# Altium project RD044-NETLIST2-CR5-01.PrjPcb
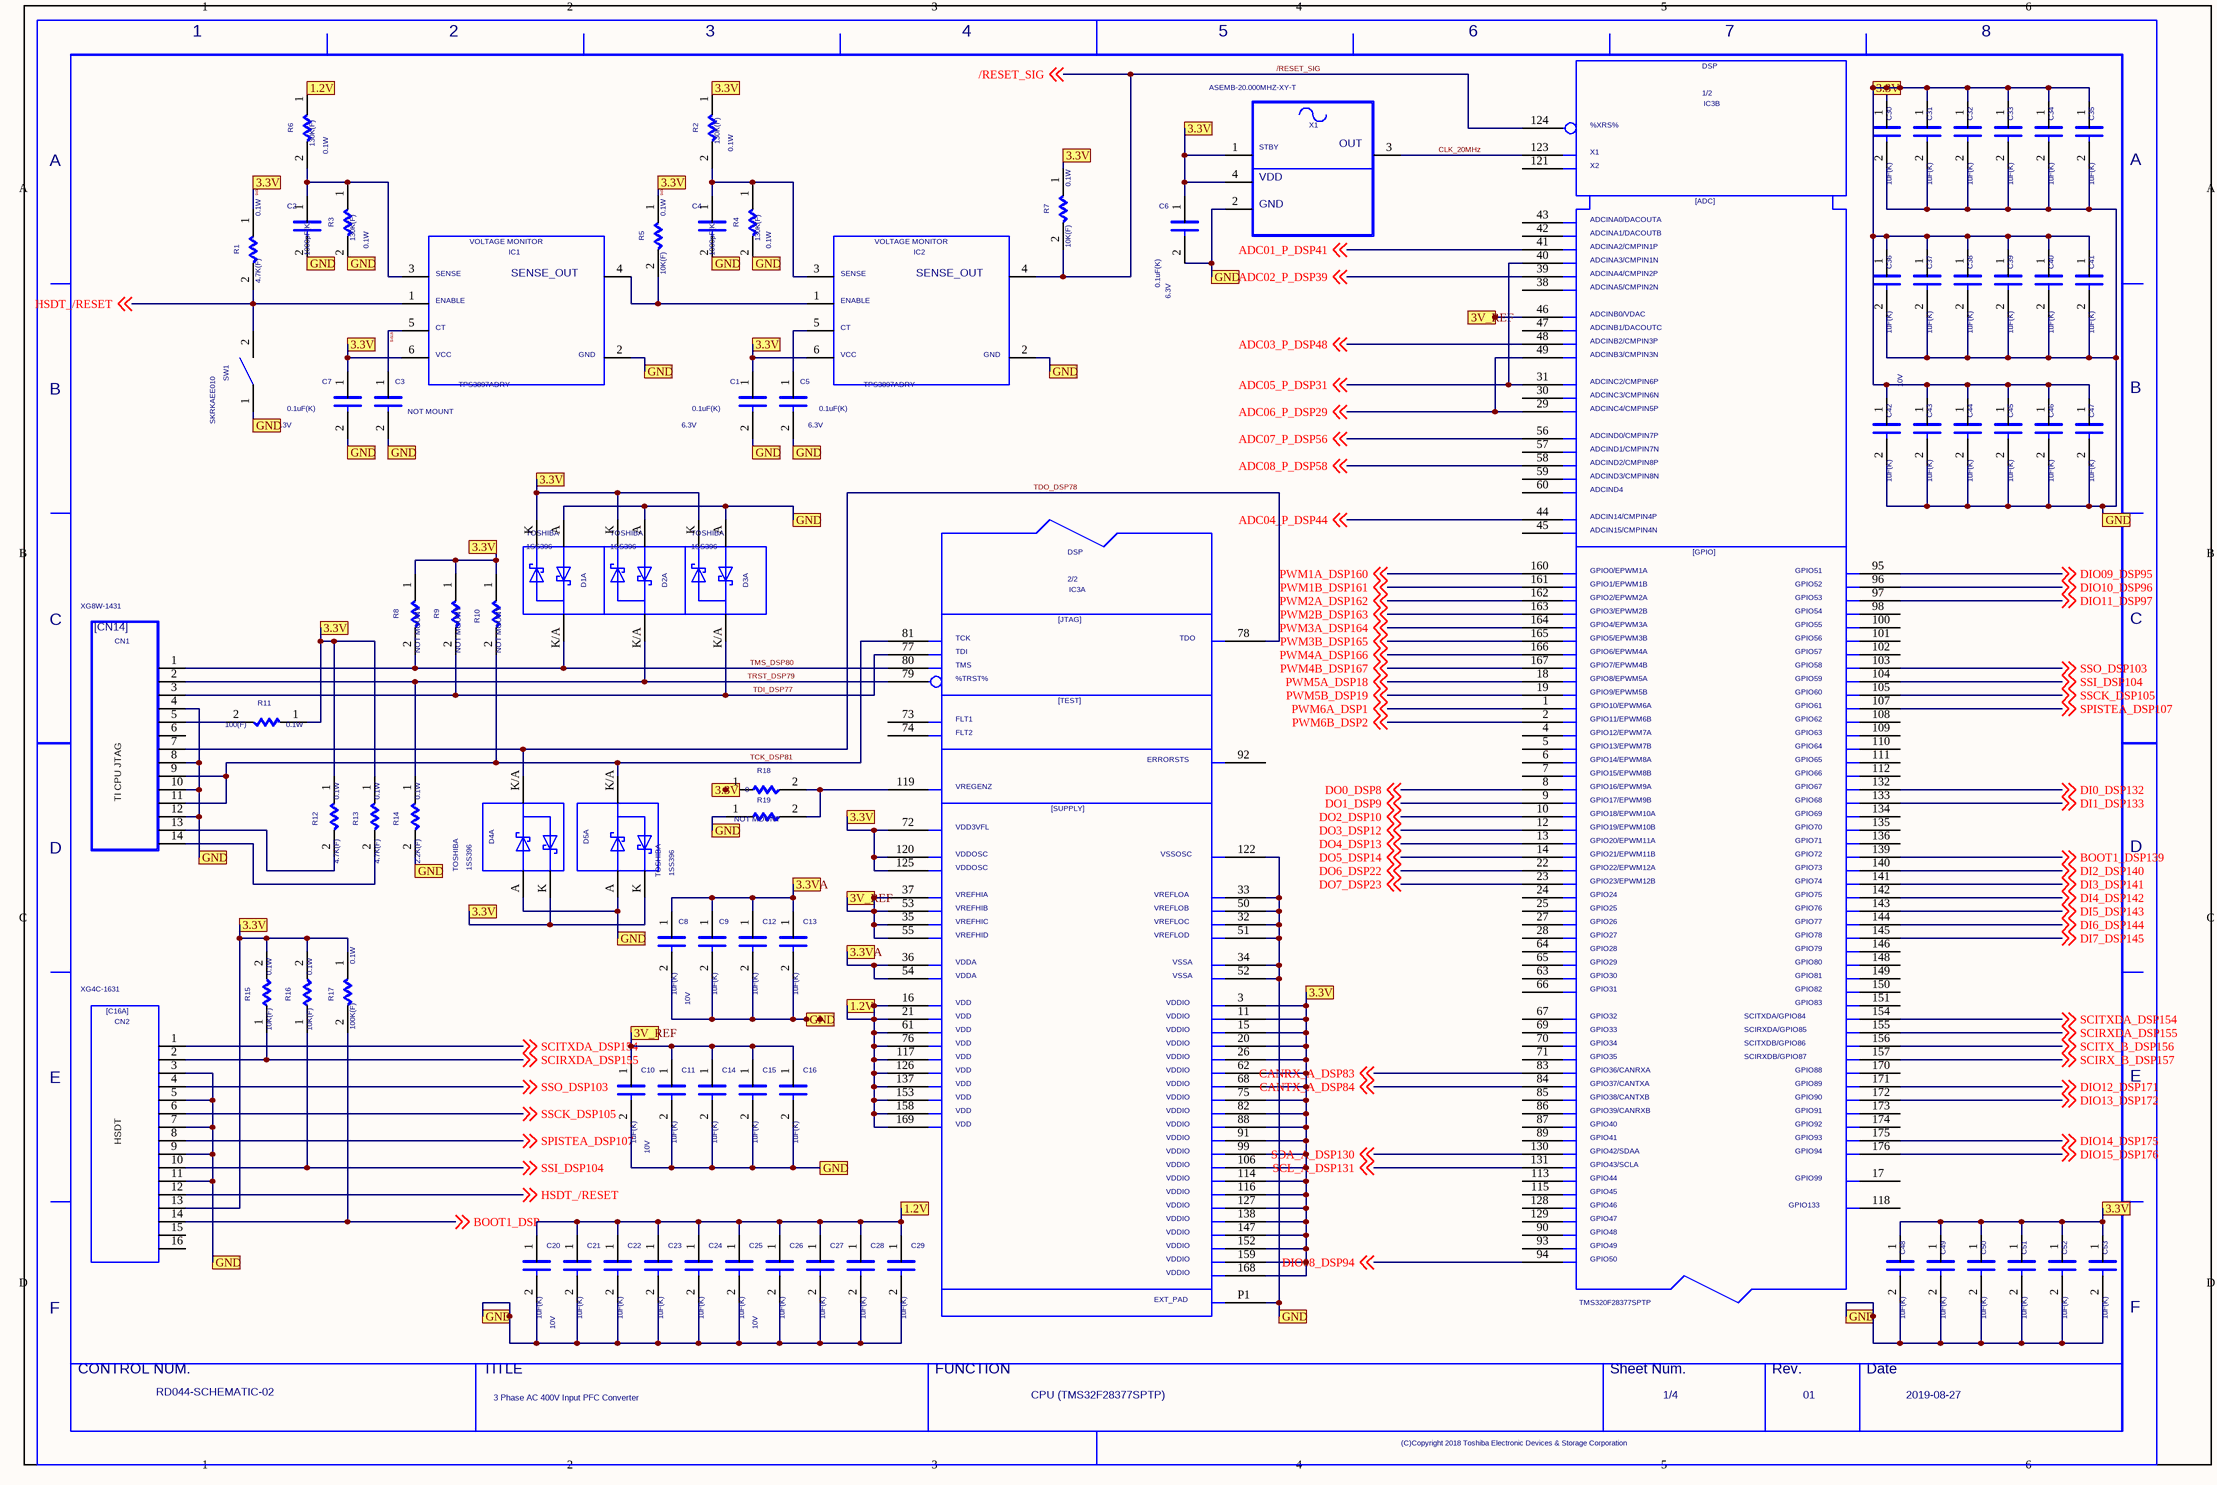
[diagram p0: 1.SchDoc]
4 sheets, 296 parts. Net scope: flat (ports and power ports of the same name join across sheets).
Sheets:
  1.SchDoc
  2.SchDoc
  3.SchDoc
  4.SchDoc

## Sheet 1.SchDoc
size 411 x 274 mm

### Parts
(Parts that share a designator on the sheet are numbered #1, #2 ... from top to bottom, then left to right.)
C1  VAL2: 6.3V  VAL1: 0.1uF(K)  (hidden comment: C)
C2  VAL2: 16V  VAL1: 1000pF(K)  (hidden comment: C)
C3  NOTMOUNT: NOT MOUNT  (hidden comment: C)
C4  VAL2: 16V  VAL1: 1000pF(K)  (hidden comment: C)
C5  VAL2: 6.3V  VAL1: 0.1uF(K)  (hidden comment: C)
C6  VAL2: 6.3V  VAL1: 0.1uF(K)  (hidden comment: C)
C7  VAL2: 6.3V  VAL1: 0.1uF(K)  (hidden comment: C)
C8  VAL2: 10V  VAL1: 1uF(K)  (hidden comment: C)
C9  VAL1: 1uF(K)  (hidden comment: C)
C10  VAL2: 10V  VAL1: 1uF(K)  (hidden comment: C)
C11  VAL1: 1uF(K)  (hidden comment: C)
C12  VAL1: 1uF(K)  (hidden comment: C)
C13  VAL1: 1uF(K)  (hidden comment: C)
C14  VAL1: 1uF(K)  (hidden comment: C)
C15  VAL1: 1uF(K)  (hidden comment: C)
C16  VAL1: 1uF(K)  (hidden comment: C)
C20  VAL2: 10V  VAL1: 1uF(K)  (hidden comment: C)
C21  VAL1: 1uF(K)  (hidden comment: C)
C22  VAL1: 1uF(K)  (hidden comment: C)
C23  VAL1: 1uF(K)  (hidden comment: C)
C24  VAL1: 1uF(K)  (hidden comment: C)
C25  VAL2: 10V  VAL1: 1uF(K)  (hidden comment: C)
C26  VAL1: 1uF(K)  (hidden comment: C)
C27  VAL1: 1uF(K)  (hidden comment: C)
C28  VAL1: 1uF(K)  (hidden comment: C)
C29  VAL1: 1uF(K)  (hidden comment: C)
C30  VAL1: 1uF(K)  (hidden comment: C)
C31  VAL1: 1uF(K)  (hidden comment: C)
C32  VAL1: 1uF(K)  (hidden comment: C)
C33  VAL1: 1uF(K)  (hidden comment: C)
C34  VAL1: 1uF(K)  (hidden comment: C)
C35  VAL1: 1uF(K)  (hidden comment: C)
C36  VAL1: 1uF(K)  (hidden comment: C)
C37  VAL1: 1uF(K)  (hidden comment: C)
C38  VAL1: 1uF(K)  (hidden comment: C)
C39  VAL1: 1uF(K)  (hidden comment: C)
C40  VAL1: 1uF(K)  (hidden comment: C)
C41  VAL1: 1uF(K)  (hidden comment: C)
C42  VAL2: 10V  VAL1: 1uF(K)  (hidden comment: C)
C43  VAL1: 1uF(K)  (hidden comment: C)
C44  VAL1: 1uF(K)  (hidden comment: C)
C45  VAL1: 1uF(K)  (hidden comment: C)
C46  VAL1: 1uF(K)  (hidden comment: C)
C47  VAL1: 1uF(K)  (hidden comment: C)
C48  VAL1: 1uF(K)  (hidden comment: C)
C49  VAL1: 1uF(K)  (hidden comment: C)
C50  VAL1: 1uF(K)  (hidden comment: C)
C51  VAL1: 1uF(K)  (hidden comment: C)
C52  VAL1: 1uF(K)  (hidden comment: C)
C53  VAL1: 1uF(K)  (hidden comment: C)
CN1  VAL3: XG8W-1431  (hidden comment: CN14)
CN2  VAL3: XG4C-1631  (hidden comment: C16A)
D1  USERCOMPTEXT3: TOSHIBA  (hidden comment: 1SS396)  (part A of 3)
D2  USERCOMPTEXT3: TOSHIBA  (hidden comment: 1SS396)  (part A of 3)
D3  USERCOMPTEXT3: TOSHIBA  (hidden comment: 1SS396)  (part A of 3)
D4  USERCOMPTEXT3: TOSHIBA  (hidden comment: 1SS396)  (part A of 3)
D5  USERCOMPTEXT3: TOSHIBA  (hidden comment: 1SS396)  (part A of 3)
IC1  VAL3: TPS3897ADRY  (hidden comment: TPS3897)
IC2  VAL3: TPS3897ADRY  (hidden comment: TPS3897)
IC3  U320F28377_1  (value not drawn)  (parts A,B of 2)
R1  VAL2: 0.1W  VAL1: 4.7K(F)  (hidden comment: R)
R2  VAL2: 0.1W  VAL1: 130K(F)  (hidden comment: R)
R3  VAL2: 0.1W  VAL1: 130K(F)  (hidden comment: R)
R4  VAL2: 0.1W  VAL1: 130K(F)  (hidden comment: R)
R5  VAL2: 0.1W  VAL1: 10K(F)  (hidden comment: R)
R6  VAL2: 0.1W  VAL1: 130K(F)  (hidden comment: R)
R7  VAL2: 0.1W  VAL1: 10K(F)  (hidden comment: R)
R8  NOTMOUNT: NOT MOUNT  (hidden comment: R)
R9  NOTMOUNT: NOT MOUNT  (hidden comment: R)
R10  NOTMOUNT: NOT MOUNT  (hidden comment: R)
R11  VAL2: 0.1W  VAL1: 100(F)  (hidden comment: R)
R12  VAL2: 0.1W  VAL1: 4.7K(F)  (hidden comment: R)
R13  VAL2: 0.1W  VAL1: 4.7K(F)  (hidden comment: R)
R14  VAL2: 0.1W  VAL1: 2.2K(F)  (hidden comment: R)
R15  VAL2: 0.1W  VAL1: 10K(F)  (hidden comment: R)
R16  VAL2: 0.1W  VAL1: 10K(F)  (hidden comment: R)
R17  VAL2: 0.1W  VAL1: 100K(F)  (hidden comment: R)
R18  VAL1: 0  (hidden comment: R)
R19  NOTMOUNT: NOT MOUNT  (hidden comment: R)
SW1  VAL3: SKRKAEE010  (hidden comment: SW)
U?#1  DATE: 2019-08-27  REVISION: 01  SHEETNUMBER: 1/4  FUNCTION: CPU (TMS32F28377SPTP)  TITLE: 3 Phase AC 400V Input PFC Converter  DRAWINGNUMBER: RD044-SCHEMATIC-02  (hidden comment: WAKU_DEF100_2018)
X1  VAL3: ASEMB-20.000MHZ-XY-T  (hidden comment: ASEMB)

### Ports
1.2V, 3.3V, 3.3VA, 3V_REF, GND

### Nets
/RESET_SIG: IC2.4 IC3.124 R7.2 ; off-sheet /RESET_SIG
ADC01_P_DSP41: IC3.41 ; off-sheet ADC01_P_DSP41
ADC02_P_DSP39: IC3.39 ; off-sheet ADC02_P_DSP39
ADC03_P_DSP48: IC3.48 ; off-sheet ADC03_P_DSP48
ADC04_P_DSP44: IC3.44 ; off-sheet ADC04_P_DSP44
ADC05_P_DSP31: IC3.31 IC3.40 ; off-sheet ADC05_P_DSP31
ADC06_P_DSP29: IC3.29 IC3.49 ; off-sheet ADC06_P_DSP29
ADC07_P_DSP56: IC3.56 ; off-sheet ADC07_P_DSP56
ADC08_P_DSP58: IC3.58 ; off-sheet ADC08_P_DSP58
BOOT1_DSP: CN2.14 R17.2 ; off-sheet BOOT1_DSP
BOOT1_DSP139: IC3.139 ; off-sheet BOOT1_DSP139
CANRX_A_DSP83: IC3.83 ; off-sheet CANRX_A_DSP83
CANTX_A_DSP84: IC3.84 ; off-sheet CANTX_A_DSP84
CLK_20MHz: IC3.123 X1.3
DI0_DSP132: IC3.132 ; off-sheet DI0_DSP132
DI1_DSP133: IC3.133 ; off-sheet DI1_DSP133
DI2_DSP140: IC3.140 ; off-sheet DI2_DSP140
DI3_DSP141: IC3.141 ; off-sheet DI3_DSP141
DI4_DSP142: IC3.142 ; off-sheet DI4_DSP142
DI5_DSP143: IC3.143 ; off-sheet DI5_DSP143
DI6_DSP144: IC3.144 ; off-sheet DI6_DSP144
DI7_DSP145: IC3.145 ; off-sheet DI7_DSP145
DIO08_DSP94: IC3.94 ; off-sheet DIO08_DSP94
DIO09_DSP95: IC3.95 ; off-sheet DIO09_DSP95
DIO10_DSP96: IC3.96 ; off-sheet DIO10_DSP96
DIO11_DSP97: IC3.97 ; off-sheet DIO11_DSP97
DIO12_DSP171: IC3.171 ; off-sheet DIO12_DSP171
DIO13_DSP172: IC3.172 ; off-sheet DIO13_DSP172
DIO14_DSP175: IC3.175 ; off-sheet DIO14_DSP175
DIO15_DSP176: IC3.176 ; off-sheet DIO15_DSP176
DO0_DSP8: IC3.8 ; off-sheet DO0_DSP8
DO1_DSP9: IC3.9 ; off-sheet DO1_DSP9
DO2_DSP10: IC3.10 ; off-sheet DO2_DSP10
DO3_DSP12: IC3.12 ; off-sheet DO3_DSP12
DO4_DSP13: IC3.13 ; off-sheet DO4_DSP13
DO5_DSP14: IC3.14 ; off-sheet DO5_DSP14
DO6_DSP22: IC3.22 ; off-sheet DO6_DSP22
DO7_DSP23: IC3.23 ; off-sheet DO7_DSP23
HSDT_/RESET: CN2.12 IC1.1 R1.2 SW1.2 ; off-sheet HSDT_/RESET
N16607086: IC1.4 IC2.1 R5.2
N16607090: C4.1 IC2.3 R2.2 R4.1
N16607182: C2.1 IC1.3 R3.1 R6.2
N16607210: C5.1 IC2.5
N16608626: CN1.5 R11.2
N16609034: CN1.13 R12.2
N16609038: CN1.14 R13.2
N16609736: IC3.119 R18.2 R19.2
PWM1A_DSP160: IC3.160 ; off-sheet PWM1A_DSP160
PWM1B_DSP161: IC3.161 ; off-sheet PWM1B_DSP161
PWM2A_DSP162: IC3.162 ; off-sheet PWM2A_DSP162
PWM2B_DSP163: IC3.163 ; off-sheet PWM2B_DSP163
PWM3A_DSP164: IC3.164 ; off-sheet PWM3A_DSP164
PWM3B_DSP165: IC3.165 ; off-sheet PWM3B_DSP165
PWM4A_DSP166: IC3.166 ; off-sheet PWM4A_DSP166
PWM4B_DSP167: IC3.167 ; off-sheet PWM4B_DSP167
PWM5A_DSP18: IC3.18 ; off-sheet PWM5A_DSP18
PWM5B_DSP19: IC3.19 ; off-sheet PWM5B_DSP19
PWM6A_DSP1: IC3.1 ; off-sheet PWM6A_DSP1
PWM6B_DSP2: IC3.2 ; off-sheet PWM6B_DSP2
SCIRX_B_DSP157: IC3.157 ; off-sheet SCIRX_B_DSP157
SCIRXDA_DSP155: CN2.2 IC3.155 R15.1 ; off-sheet SCIRXDA_DSP155
SCITX_B_DSP156: IC3.156 ; off-sheet SCITX_B_DSP156
SCITXDA_DSP154: CN2.1 IC3.154 ; off-sheet SCITXDA_DSP154
SCL_A_DSP131: IC3.131 ; off-sheet SCL_A_DSP131
SDA_A_DSP130: IC3.130 ; off-sheet SDA_A_DSP130
SIG15: C3.1 IC1.5
SIG206: C1.2 C2.2 C3.2 C4.2 C5.2 C6.2 C7.2 C8.2 C9.2 C10.2 C11.2 C12.2 C13.2 C14.2 C15.2 C16.2 C20.2 C21.2 C22.2 C23.2 C24.2 C25.2 C26.2 C27.2 C28.2 C29.2 C30.2 C31.2 C32.2 C33.2 C34.2 C35.2 C36.2 C37.2 C38.2 C39.2 C40.2 C41.2 C42.2 C43.2 C44.2 C45.2 C46.2 C47.2 C48.2 C49.2 C50.2 C51.2 C52.2 C53.2 CN1.4 CN1.8 CN1.10 CN1.12 CN2.3 CN2.5 CN2.7 CN2.9 CN2.11 D1.A D2.A D3.A D4.A D5.A IC1.2 IC2.2 IC3.32 IC3.33 IC3.34 IC3.50 IC3.51 IC3.52 IC3.122 IC3.P1 R3.2 R4.2 R14.2 R19.1 SW1.1 X1.2 ; port GND
SIG462: C1.1 C6.1 C7.1 C30.1 C31.1 C32.1 C33.1 C34.1 C35.1 C36.1 C37.1 C38.1 C39.1 C40.1 C41.1 C42.1 C43.1 C44.1 C45.1 C46.1 C47.1 C48.1 C49.1 C50.1 C51.1 C52.1 C53.1 CN2.13 D1.K D2.K D3.K D4.K D5.K IC1.6 IC2.6 IC3.3 IC3.11 IC3.15 IC3.20 IC3.26 IC3.62 IC3.68 IC3.72 IC3.75 IC3.82 IC3.88 IC3.91 IC3.99 IC3.106 IC3.114 IC3.116 IC3.120 IC3.125 IC3.127 IC3.138 IC3.147 IC3.152 IC3.159 IC3.168 R1.1 R2.1 R5.1 R7.1 R8.1 R9.1 R10.1 R11.1 R12.1 R13.1 R15.2 R16.2 R17.1 R18.1 X1.1 X1.4 ; port 3.3V  [also labelled SIG464]
SPISTEA_DSP107: CN2.8 IC3.107 ; off-sheet SPISTEA_DSP107
SSCK_DSP105: CN2.6 IC3.105 ; off-sheet SSCK_DSP105
SSI_DSP104: CN2.10 IC3.104 R16.1 ; off-sheet SSI_DSP104
SSO_DSP103: CN2.4 IC3.103 ; off-sheet SSO_DSP103
TCK_DSP81: CN1.9 CN1.11 D5.K/A IC3.81 R10.2
TDI_DSP77: CN1.3 D3.K/A IC3.77 R9.2
TDO_DSP78: CN1.7 D4.K/A IC3.78
TMS_DSP80: CN1.1 D1.K/A IC3.80 R8.2
TRST_DSP79: CN1.2 D2.K/A IC3.79 R14.1
NetC8_1: C8.1 C9.1 C12.1 C13.1 IC3.36 IC3.54 ; port 3.3VA
NetC10_1: C10.1 C11.1 C14.1 C15.1 C16.1 IC3.35 IC3.37 IC3.46 IC3.53 IC3.55 ; port 3V_REF
NetC20_1: C20.1 C21.1 C22.1 C23.1 C24.1 C25.1 C26.1 C27.1 C28.1 C29.1 IC3.16 IC3.21 IC3.61 IC3.76 IC3.117 IC3.126 IC3.137 IC3.153 IC3.158 IC3.169 R6.1 ; port 1.2V

Not connected (* = marked no-connect by the designer): CN1 6; CN2 15 16; IC3 4 5 6 7 17 24 25 27 28 30 38 42 43 45 47 57 59 60 63 64 65 66 67 69 70 71 73 74 85 86 87 89 90 92 93 98 100 101 102 108 109 110 111 112 113 115 118 121 128 129 134 135 136 146 148 149 150 151 170 173 174

### Notes on the sheet
- (near CN1) TI CPU JTAG
- (near CN2) HSDT
- (in symbol ASEMB) OUT; STBY; VDD; GND
- (in symbol C16A) [C16A]
- (in symbol CN14) [CN14]
- (in symbol TPS3897) VOLTAGE MONITOR; SENSE; SENSE_OUT; ENABLE; CT; VCC; GND
- (in symbol U320F28377_1, part A) DSP; 2/2; [JTAG]; TCK; TDO; TDI; TMS; %TRST%; [TEST]; FLT1; FLT2; ERRORSTS; VREGENZ; [SUPPLY]; VDD3VFL; VDDOSC; VSSOSC; VREFHIA; VREFLOA; VREFHIB; VREFLOB; VREFHIC; VREFLOC; VREFHID; VREFLOD; VDDA; VSSA; VDD; VDDIO; EXT_PAD
- (in symbol U320F28377_1, part B) DSP; 1/2; %XRS%; X1; X2; [ADC]; ADCINA0/DACOUTA; ADCINA1/DACOUTB; ADCINA2/CMPIN1P; ADCINA3/CMPIN1N; ADCINA4/CMPIN2P; ADCINA5/CMPIN2N; ADCINB0/VDAC; ADCINB1/DACOUTC; ADCINB2/CMPIN3P; ADCINB3/CMPIN3N; ADCINC2/CMPIN6P; ADCINC3/CMPIN6N; ADCINC4/CMPIN5P; ADCIND0/CMPIN7P; ADCIND1/CMPIN7N; ADCIND2/CMPIN8P; ADCIND3/CMPIN8N; ADCIND4; ADCIN14/CMPIN4P; ADCIN15/CMPIN4N; [GPIO]; GPIO0/EPWM1A; GPIO51; GPIO1/EPWM1B; GPIO52; GPIO2/EPWM2A; GPIO53; GPIO3/EPWM2B; GPIO54; GPIO4/EPWM3A; GPIO55; GPIO5/EPWM3B; GPIO56; GPIO6/EPWM4A; GPIO57; GPIO7/EPWM4B; GPIO58; GPIO8/EPWM5A; GPIO59; GPIO9/EPWM5B; GPIO60; GPIO10/EPWM6A; GPIO61; GPIO11/EPWM6B; GPIO62; GPIO12/EPWM7A; GPIO63; GPIO13/EPWM7B; GPIO64; GPIO14/EPWM8A; GPIO65; GPIO15/EPWM8B; GPIO66; GPIO16/EPWM9A; GPIO67; GPIO17/EPWM9B; GPIO68; GPIO18/EPWM10A; GPIO69; GPIO19/EPWM10B; GPIO70; GPIO20/EPWM11A; GPIO71; GPIO21/EPWM11B; GPIO72; GPIO22/EPWM12A; GPIO73; GPIO23/EPWM12B; GPIO74; GPIO24; GPIO75; GPIO25; GPIO76; GPIO26; GPIO77; GPIO27; GPIO78; GPIO28; GPIO79; GPIO29; GPIO80; GPIO30; GPIO81; GPIO31; GPIO82; GPIO83; GPIO32; SCITXDA/GPIO84; GPIO33; SCIRXDA/GPIO85; GPIO34; SCITXDB/GPIO86; GPIO35; SCIRXDB/GPIO87; GPIO36/CANRXA; GPIO88; GPIO37/CANTXA; GPIO89; GPIO38/CANTXB; GPIO90; GPIO39/CANRXB; GPIO91; GPIO40; GPIO92; GPIO41; GPIO93; GPIO42/SDAA; GPIO94; GPIO43/SCLA; GPIO44; GPIO99; GPIO45; GPIO46; GPIO133; GPIO47; GPIO48; GPIO49; GPIO50
- (in symbol WAKU_DEF100_2018) 1; 3; 5; 6; 7; 8; A; B; C; D; E; F; CONTROL NUM.; TITLE; FUNCTION; Sheet Num.; Rev.; Date; (C)Copyright 2018 Toshiba Electronic Devices & Storage Corporation

### Library data of the parts
C1 C5-C7 = C: PARTNAME: C-GRM155R70J104KA01D; OriginalSymbolOrigin: (2540,7620); USERCOMPTEXT1: 1005; COMPONENTTYPE: 4; COMPONENTKIND: 108
C2 C4 = C: PARTNAME: C-GRM188R71C102KA01D; OriginalSymbolOrigin: (2540,7620); USERCOMPTEXT1: 1608; COMPONENTTYPE: 4; COMPONENTKIND: 108
C3 = C: PARTNAME: C-1608_NM; OriginalSymbolOrigin: (2540,7620); USERCOMPTEXT1: 1608; COMPONENTTYPE: 4; COMPONENTKIND: 108
C8 C10 C20 C25 C42 = C: PARTNAME: C-GRM188R71A105KA61D; OriginalSymbolOrigin: (2540,7620); USERCOMPTEXT1: 1608; COMPONENTTYPE: 4; COMPONENTKIND: 108
C9 C11-C16 C21-C24 C26-C41 C43-C53 = C: PARTNAME: C-GRM188R71A105KA61D; OriginalSymbolOrigin: (2540,7620); COMPONENTTYPE: 4; COMPONENTKIND: 108
CN1 = CN14: PARTNAME: CN-XG8W-1431; OUMEPARTTYPE: CN; OriginalSymbolOrigin: (2540,45720); RATEDCURRENT: 3; MAXGCOUNT: 1; OUMEMAKER: OMR オャ鴻・; NUMBEROFCONTACT: 14; FNLEADFREETHET1GT2GMCTH1: N_N_N; OUMECLASSIFICATION: プリント板用角形コネクタ; CONTACTPITCH: 2.54m; ADSCNVFLAG: ON; COMPONENTTYPE: 4; COMPONENTKIND: 111; GCOUNT: 1; OUMEMAKERKATAMEI: XG8W-1431
CN2 = C16A: PARTNAME: CN-XG4C-1631; SAVEAREA0: -32851,-599,52300,52191; TIME: 12:01:18; UPDATEUSER: fukuda-y; UPDATETIME: 13:44:49; SAVECOUNT: 2; OriginalSymbolOrigin: (2540,48260); COMPONENTTYPE: 4; COMPONENTKIND: 135; AUTHOR: fukuda-y; DATE: 2005/02/01; UPDATEDATE: 2005/02/01
D1-D5 = 1SS396: PARTNAME: D-1SS396_AK; SAVECOUNT: 7; SAVEAREA0: -5465,-437,27678,21425; TIME: 18:51:12; UPDATEUSER: cae; UPDATETIME: 10:39:29; OriginalSymbolOrigin: (5080,17780); COMPONENTTYPE: 4; COMPONENTKIND: 103; AUTHOR: sato-yr; DATE: 2002/11/26; UPDATEDATE: 2019/08/02; VAL3: 1SS396
IC1 IC2 = TPS3897: PARTNAME: IC-TPS3897ADRY; SAVEAREA0: -10817,-344,54055,33349; TIME: 16:54:57; UPDATEUSER: cae; UPDATETIME: 13:48:08; SAVECOUNT: 66; OriginalSymbolOrigin: (5080,30480); COMPONENTTYPE: 4; COMPONENTKIND: 101; AUTHOR: iketani; DATE: 2006/02/27; UPDATEDATE: 2019/07/10
IC3 = U320F28377_1: PARTNAME: IC-TMS320F28377SPTP; SAVEAREA0: -157495,-2464,228972,238585; SAVECOUNT: 59; TIME: 10:04:23; UPDATEUSER: cae; UPDATETIME: 18:05:54; OriginalSymbolOrigin: (7620,233680); CaptureCellPackProp: U320F28377_1A; VAL3: TMS320F28377SPTP; FUNCTION: TMS320F_2_function; COMPONENTTYPE: 8; COMPONENTKIND: 101; AUTHOR: sawabe-h; DATE: 2004/02/19; UPDATEDATE: 2019/07/11
R1 R12 R13 = R: PARTNAME: R-ERJ3EKF4701V; OriginalSymbolOrigin: (5080,5080); USERCOMPTEXT1: 1608; COMPONENTTYPE: 4; COMPONENTKIND: 105
R2 = R: PARTNAME: R-ERA3AEB304V; OriginalSymbolOrigin: (5080,5080); USERCOMPTEXT1: 1608; COMPONENTTYPE: 4; COMPONENTKIND: 105
R3 R17 = R: PARTNAME: R-ERJ3EKF1003V; OriginalSymbolOrigin: (5080,5080); USERCOMPTEXT1: 1608; COMPONENTTYPE: 4; COMPONENTKIND: 105
R4 = R: PARTNAME: R-ERA3AEB563V; OriginalSymbolOrigin: (5080,5080); USERCOMPTEXT1: 1608; COMPONENTTYPE: 4; COMPONENTKIND: 105
R5 R7 R15 R16 = R: PARTNAME: R-ERJ3EKF1002V; OriginalSymbolOrigin: (5080,5080); USERCOMPTEXT1: 1608; COMPONENTTYPE: 4; COMPONENTKIND: 105
R6 = R: PARTNAME: R-ERA3AEB134V; OriginalSymbolOrigin: (5080,5080); USERCOMPTEXT1: 1608; COMPONENTTYPE: 4; COMPONENTKIND: 105
R8-R10 R19 = R: PARTNAME: R-1608_NM; OriginalSymbolOrigin: (5080,5080); USERCOMPTEXT1: 1608; COMPONENTTYPE: 4; COMPONENTKIND: 105
R11 = R: PARTNAME: R-ERJ3EKF1000V; OriginalSymbolOrigin: (5080,5080); USERCOMPTEXT1: 1608; COMPONENTTYPE: 4; COMPONENTKIND: 105
R14 = R: PARTNAME: R-ERJ3EKF2201V; OriginalSymbolOrigin: (5080,5080); USERCOMPTEXT1: 1608; COMPONENTTYPE: 4; COMPONENTKIND: 105
R18 = R: PARTNAME: R-RK73Z1JTTD; OriginalSymbolOrigin: (5080,5080); COMPONENTTYPE: 4; COMPONENTKIND: 105
SW1 = SW: PARTNAME: SW-SKRKAEE010; OUMEPARTTYPE: S; SAVEAREA0: -3361,-153,18383,13055; SAVECOUNT: 49; TIME: 15:02:55; UPDATEUSER: fukuda-y; UPDATETIME: 10:01:15; OriginalSymbolOrigin: (5080,5080); RATEDCURRENT: 50m; RATEDVOLTAGE: 12; MAXGCOUNT: 1; OUMEMAKER: ALP アルプス電気; MOUNTINGDIRECTI: VERTICAL; FNLEADFREETHET1GT2GMCTH1: 2_9_N; OUMECLASSIFICATION: プッシュボタン; MOUNTINGFORM: SMD; PMPRODUCTSTYPEG: PC1; ADSCNVFLAG: ON; CDMASTERCADCELG: OP0064; NUMBEROFPOSITIO: 2; COMPONENTTYPE: 4; COMPONENTKIND: 115; AUTHOR: fukuda-y; DATE: 2001/10/19; UPDATEDATE: 2006/10/04; GCOUNT: 1; OUMEMAKERKATAMEI: SKRKAEE010
U?#1 = WAKU_DEF100_2018: PLOTTIME: HH:MM; SAVEAREA0: -45080,-4508,463680,304612; TIME: 13:54:34; UPDATEUSER: t5459927; UPDATETIME: 12:04:35; SAVECOUNT: 4; OriginalSymbolOrigin: (10160,284480); COMPONENTTYPE: 2; COMPONENTKIND: 0; PLOTDATE: YYYY.MM.DD; AUTHOR: cae; UPDATEDATE: 2019/08/29
X1 = ASEMB: PARTNAME: X-ASEMB-20.000MHZ-XY-T; SAVEAREA0: -13388,-318,46493,30783; TIME: 14:56:21; UPDATEUSER: cae; UPDATETIME: 14:57:23; SAVECOUNT: 2; OriginalSymbolOrigin: (5080,27940); COMPONENTTYPE: 4; COMPONENTKIND: 118; AUTHOR: cae; DATE: 2019/07/10; UPDATEDATE: 2019/07/10

## Sheet 2.SchDoc
size 420 x 297 mm
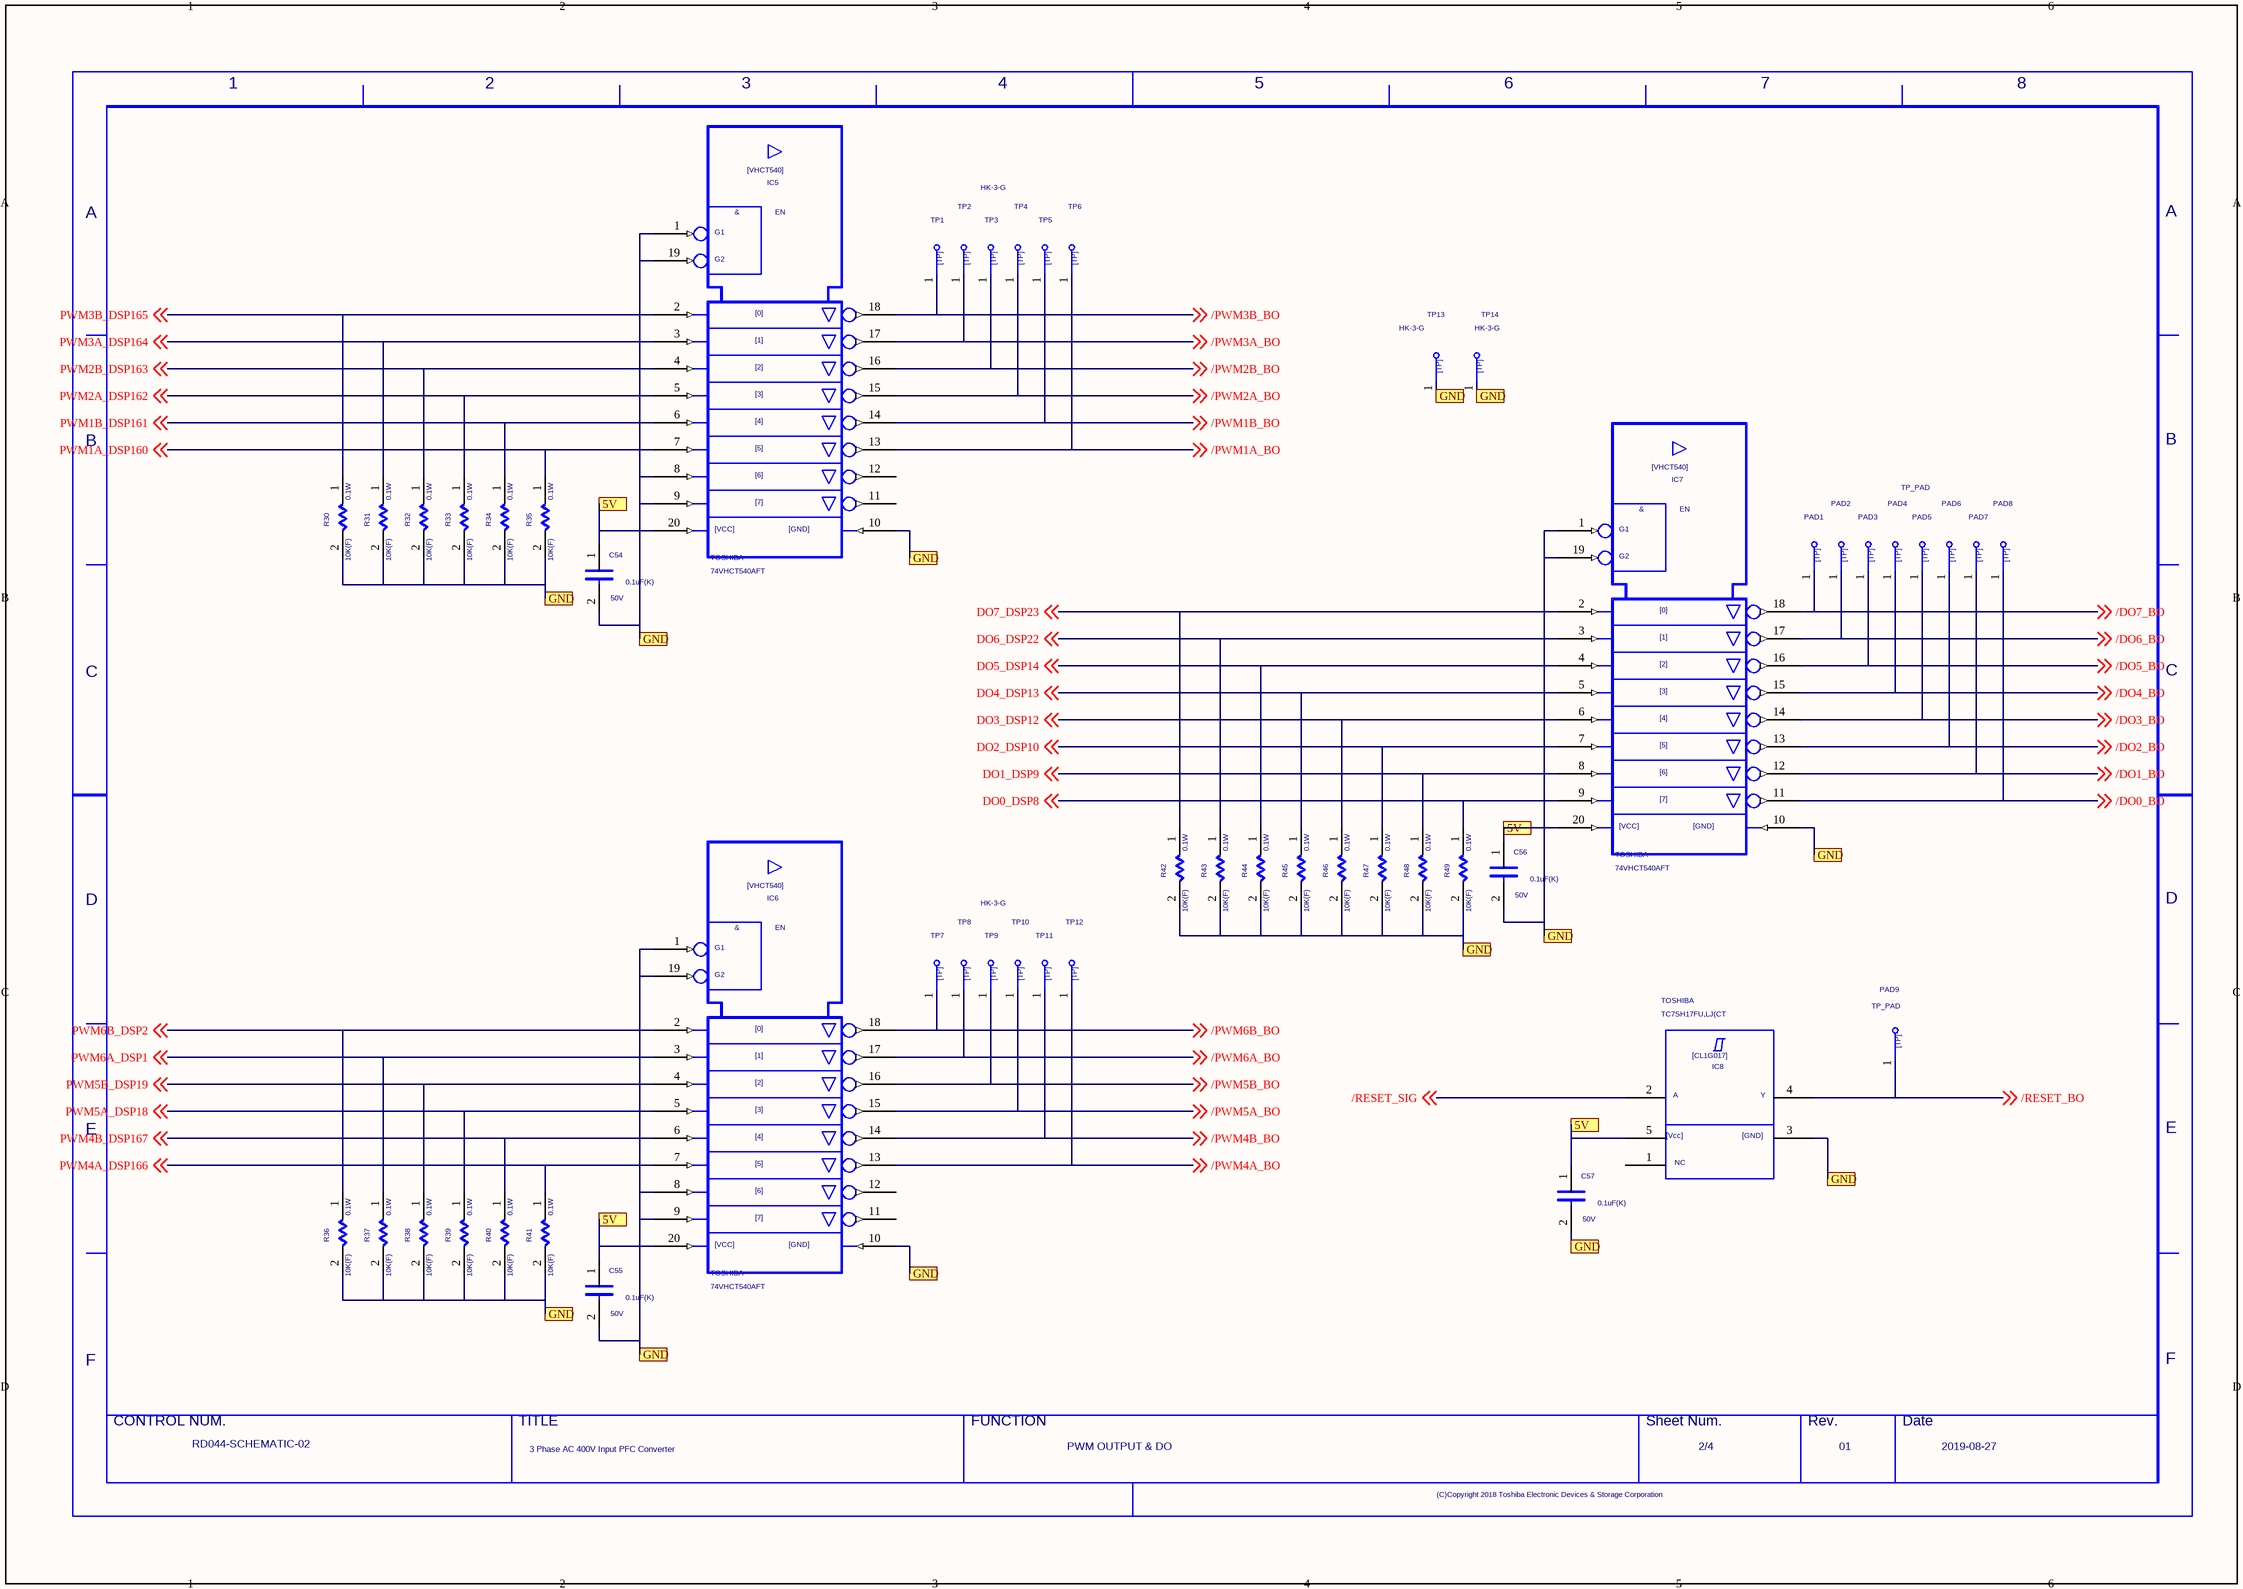
[diagram p1: 2.SchDoc]

### Parts
(Parts that share a designator on the sheet are numbered #1, #2 ... from top to bottom, then left to right.)
C54  VAL2: 50V  VAL1: 0.1uF(K)  (hidden comment: C)
C55  VAL2: 50V  VAL1: 0.1uF(K)  (hidden comment: C)
C56  VAL2: 50V  VAL1: 0.1uF(K)  (hidden comment: C)
C57  VAL2: 50V  VAL1: 0.1uF(K)  (hidden comment: C)
IC5  USERCOMPTEXT3: TOSHIBA  VAL3: 74VHCT540AFT  (hidden comment: VHC540)
IC6  USERCOMPTEXT3: TOSHIBA  VAL3: 74VHCT540AFT  (hidden comment: VHC540)
IC7  USERCOMPTEXT3: TOSHIBA  VAL3: 74VHCT540AFT  (hidden comment: VHC540)
IC8  USERCOMPTEXT3: TOSHIBA  VAL3: TC7SH17FU,LJ(CT  (hidden comment: CL1G017)
PAD1  TP  (value not drawn)
PAD2  VAL3: TP_PAD  (hidden comment: TP)
PAD3  TP  (value not drawn)
PAD4  TP  (value not drawn)
PAD5  TP  (value not drawn)
PAD6  TP  (value not drawn)
PAD7  TP  (value not drawn)
PAD8  TP  (value not drawn)
PAD9  VAL3: TP_PAD  (hidden comment: TP)
R30  VAL2: 0.1W  VAL1: 10K(F)  (hidden comment: R)
R31  VAL2: 0.1W  VAL1: 10K(F)  (hidden comment: R)
R32  VAL2: 0.1W  VAL1: 10K(F)  (hidden comment: R)
R33  VAL2: 0.1W  VAL1: 10K(F)  (hidden comment: R)
R34  VAL2: 0.1W  VAL1: 10K(F)  (hidden comment: R)
R35  VAL2: 0.1W  VAL1: 10K(F)  (hidden comment: R)
R36  VAL2: 0.1W  VAL1: 10K(F)  (hidden comment: R)
R37  VAL2: 0.1W  VAL1: 10K(F)  (hidden comment: R)
R38  VAL2: 0.1W  VAL1: 10K(F)  (hidden comment: R)
R39  VAL2: 0.1W  VAL1: 10K(F)  (hidden comment: R)
R40  VAL2: 0.1W  VAL1: 10K(F)  (hidden comment: R)
R41  VAL2: 0.1W  VAL1: 10K(F)  (hidden comment: R)
R42  VAL2: 0.1W  VAL1: 10K(F)  (hidden comment: R)
R43  VAL2: 0.1W  VAL1: 10K(F)  (hidden comment: R)
R44  VAL2: 0.1W  VAL1: 10K(F)  (hidden comment: R)
R45  VAL2: 0.1W  VAL1: 10K(F)  (hidden comment: R)
R46  VAL2: 0.1W  VAL1: 10K(F)  (hidden comment: R)
R47  VAL2: 0.1W  VAL1: 10K(F)  (hidden comment: R)
R48  VAL2: 0.1W  VAL1: 10K(F)  (hidden comment: R)
R49  VAL2: 0.1W  VAL1: 10K(F)  (hidden comment: R)
TP1  TP  (value not drawn)
TP2  VAL3: HK-3-G  (hidden comment: TP)
TP3  TP  (value not drawn)
TP4  TP  (value not drawn)
TP5  TP  (value not drawn)
TP6  TP  (value not drawn)
TP7  TP  (value not drawn)
TP8  VAL3: HK-3-G  (hidden comment: TP)
TP9  TP  (value not drawn)
TP10  TP  (value not drawn)
TP11  TP  (value not drawn)
TP12  TP  (value not drawn)
TP13  VAL3: HK-3-G  (hidden comment: TP)
TP14  VAL3: HK-3-G  (hidden comment: TP)
U?#2  DATE: 2019-08-27  REVISION: 01  SHEETNUMBER: 2/4  FUNCTION: PWM OUTPUT & DO  TITLE: 3 Phase AC 400V Input PFC Converter  DRAWINGNUMBER: RD044-SCHEMATIC-02  (hidden comment: WAKU_DEF100_2018)

### Ports
5V, GND

### Nets
/DO0_BO: IC7.11 PAD8.1 ; off-sheet /DO0_BO
/DO1_BO: IC7.12 PAD7.1 ; off-sheet /DO1_BO
/DO2_BO: IC7.13 PAD6.1 ; off-sheet /DO2_BO
/DO3_BO: IC7.14 PAD5.1 ; off-sheet /DO3_BO
/DO4_BO: IC7.15 PAD4.1 ; off-sheet /DO4_BO
/DO5_BO: IC7.16 PAD3.1 ; off-sheet /DO5_BO
/DO6_BO: IC7.17 PAD2.1 ; off-sheet /DO6_BO
/DO7_BO: IC7.18 PAD1.1 ; off-sheet /DO7_BO
/PWM1A_BO: IC5.13 TP6.1 ; off-sheet /PWM1A_BO
/PWM1B_BO: IC5.14 TP5.1 ; off-sheet /PWM1B_BO
/PWM2A_BO: IC5.15 TP4.1 ; off-sheet /PWM2A_BO
/PWM2B_BO: IC5.16 TP3.1 ; off-sheet /PWM2B_BO
/PWM3A_BO: IC5.17 TP2.1 ; off-sheet /PWM3A_BO
/PWM3B_BO: IC5.18 TP1.1 ; off-sheet /PWM3B_BO
/PWM4A_BO: IC6.13 TP12.1 ; off-sheet /PWM4A_BO
/PWM4B_BO: IC6.14 TP11.1 ; off-sheet /PWM4B_BO
/PWM5A_BO: IC6.15 TP10.1 ; off-sheet /PWM5A_BO
/PWM5B_BO: IC6.16 TP9.1 ; off-sheet /PWM5B_BO
/PWM6A_BO: IC6.17 TP8.1 ; off-sheet /PWM6A_BO
/PWM6B_BO: IC6.18 TP7.1 ; off-sheet /PWM6B_BO
/RESET_BO: IC8.4 PAD9.1 ; off-sheet /RESET_BO
/RESET_SIG: IC8.2 ; off-sheet /RESET_SIG
DO0_DSP8: IC7.9 R49.1 ; off-sheet DO0_DSP8
DO1_DSP9: IC7.8 R48.1 ; off-sheet DO1_DSP9
DO2_DSP10: IC7.7 R47.1 ; off-sheet DO2_DSP10
DO3_DSP12: IC7.6 R46.1 ; off-sheet DO3_DSP12
DO4_DSP13: IC7.5 R45.1 ; off-sheet DO4_DSP13
DO5_DSP14: IC7.4 R44.1 ; off-sheet DO5_DSP14
DO6_DSP22: IC7.3 R43.1 ; off-sheet DO6_DSP22
DO7_DSP23: IC7.2 R42.1 ; off-sheet DO7_DSP23
PWM1A_DSP160: IC5.7 R35.1 ; off-sheet PWM1A_DSP160
PWM1B_DSP161: IC5.6 R34.1 ; off-sheet PWM1B_DSP161
PWM2A_DSP162: IC5.5 R33.1 ; off-sheet PWM2A_DSP162
PWM2B_DSP163: IC5.4 R32.1 ; off-sheet PWM2B_DSP163
PWM3A_DSP164: IC5.3 R31.1 ; off-sheet PWM3A_DSP164
PWM3B_DSP165: IC5.2 R30.1 ; off-sheet PWM3B_DSP165
PWM4A_DSP166: IC6.7 R41.1 ; off-sheet PWM4A_DSP166
PWM4B_DSP167: IC6.6 R40.1 ; off-sheet PWM4B_DSP167
PWM5A_DSP18: IC6.5 R39.1 ; off-sheet PWM5A_DSP18
PWM5B_DSP19: IC6.4 R38.1 ; off-sheet PWM5B_DSP19
PWM6A_DSP1: IC6.3 R37.1 ; off-sheet PWM6A_DSP1
PWM6B_DSP2: IC6.2 R36.1 ; off-sheet PWM6B_DSP2
SIG206: C54.2 C55.2 C56.2 C57.2 IC5.1 IC5.8 IC5.9 IC5.10 IC5.19 IC6.1 IC6.8 IC6.9 IC6.10 IC6.19 IC7.1 IC7.10 IC7.19 IC8.3 R30.2 R31.2 R32.2 R33.2 R34.2 R35.2 R36.2 R37.2 R38.2 R39.2 R40.2 R41.2 R42.2 R43.2 R44.2 R45.2 R46.2 R47.2 R48.2 R49.2 TP13.1 TP14.1 ; port GND
NetC54_1: C54.1 C55.1 C56.1 C57.1 IC5.20 IC6.20 IC7.20 IC8.5 ; port 5V

Not connected (* = marked no-connect by the designer): IC5 11 12; IC6 11 12; IC8 1

### Notes on the sheet
- (in symbol CL1G017) [CL1G017]; A; Y; [Vcc]; [GND]; NC
- (in symbol TP) [TP]
- (in symbol VHC540) [VHCT540]; &; EN; G1; G2; [0]; [1]; [2]; [3]; [4]; [5]; [6]; [7]; [VCC]; [GND]
- (in symbol WAKU_DEF100_2018) 1; 3; 5; 6; 7; 8; A; B; C; D; E; F; CONTROL NUM.; TITLE; FUNCTION; Sheet Num.; Rev.; Date; (C)Copyright 2018 Toshiba Electronic Devices & Storage Corporation

### Library data of the parts
C54-C57 = C: PARTNAME: C-GRM188R71H104KA93D; OriginalSymbolOrigin: (2540,7620); USERCOMPTEXT1: 1608; COMPONENTTYPE: 4; COMPONENTKIND: 108
IC5-IC7 = VHC540: PARTNAME: IC-74VHCT540AFT; SAVEAREA0: -64373,-927,110287,89788; TIME: 09:37:32; UPDATEUSER: cae; SAVECOUNT: 1; OriginalSymbolOrigin: (7620,83820); COMPONENTTYPE: 4; COMPONENTKIND: 101; AUTHOR: cae; DATE: 2019/07/12; UPDATEDATE: 2019/07/12; UPDATETIME: 09:37:32
IC8 = CL1G017: PARTNAME: IC-TC7SH17F; OUMEPARTTYPE: IC; TIME: 16:09:43; UPDATEUSER: tomizawa-y; UPDATETIME: 12:13:51; SAVECOUNT: 12; SAVEAREA0: -8892,-376,44463,33313; OriginalSymbolOrigin: (7620,30480); MAXGCOUNT: 1; OUMEMAKER: TSB 東芝; MOUNTINGFORMSMD: SMD; FNLEADFREETHET1GT2GMCTH1: 2_0_N; OUMECLASSIFICATION: CMOSロジック; PMPRODUCTSTYPEG: PC1; ADSCNVFLAG: ON; PROCESS: 74VHC; CDMASTERCADCELG: DIC8C8; COMPONENTTYPE: 4; COMPONENTKIND: 101; AUTHOR: e2117910; DATE: 2003/02/06; UPDATEDATE: 2004/03/26; GCOUNT: 1; OUMEMAKERKATAMEI: TC7SH17FU,LJ(CT; VAL1: TC7SH17FU,LJ(CT
PAD1 PAD7 PAD8 = TP: PARTNAME: TP-PAD1.0; TIME: 16:12:21; UPDATEUSER: fukuda-y; UPDATETIME: 16:18:11; SAVECOUNT: 2; SAVEAREA0: -242,-92,12810,7836; OriginalSymbolOrigin: (0,7620); VAL3: TP_PAD; COMPONENTTYPE: 4; COMPONENTKIND: 128; AUTHOR: fukuda-y; DATE: 2006/10/04; UPDATEDATE: 2006/10/04
PAD2 PAD9 = TP: PARTNAME: TP-PAD1.0; TIME: 16:12:21; UPDATEUSER: fukuda-y; UPDATETIME: 16:18:11; SAVECOUNT: 2; SAVEAREA0: -242,-92,12810,7836; OriginalSymbolOrigin: (0,7620); COMPONENTTYPE: 4; COMPONENTKIND: 128; AUTHOR: fukuda-y; DATE: 2006/10/04; UPDATEDATE: 2006/10/04
PAD3-PAD6 = TP: PARTNAME: TP-PAD1.0; TIME: 16:12:21; UPDATEUSER: fukuda-y; UPDATETIME: 16:18:11; SAVECOUNT: 2; SAVEAREA0: -242,-92,12810,7836; OriginalSymbolOrigin: (0,7620); VAL3: HK-3-G; COMPONENTTYPE: 4; COMPONENTKIND: 128; AUTHOR: fukuda-y; DATE: 2006/10/04; UPDATEDATE: 2006/10/04
R30-R49 = R: as R5 on sheet 1; COMPONENTTYPE: 4; COMPONENTKIND: 105
TP1 TP3-TP7 TP9-TP12 = TP: PARTNAME: TP-HK-3-G; TIME: 16:12:21; UPDATEUSER: fukuda-y; UPDATETIME: 16:18:11; SAVECOUNT: 2; SAVEAREA0: -242,-92,12810,7836; OriginalSymbolOrigin: (0,7620); VAL3: HK-3-G; COMPONENTTYPE: 4; COMPONENTKIND: 128; AUTHOR: fukuda-y; DATE: 2006/10/04; UPDATEDATE: 2006/10/04
TP2 TP8 TP13 TP14 = TP: PARTNAME: TP-HK-3-G; TIME: 16:12:21; UPDATEUSER: fukuda-y; UPDATETIME: 16:18:11; SAVECOUNT: 2; SAVEAREA0: -242,-92,12810,7836; OriginalSymbolOrigin: (0,7620); COMPONENTTYPE: 4; COMPONENTKIND: 128; AUTHOR: fukuda-y; DATE: 2006/10/04; UPDATEDATE: 2006/10/04
U?#2 = WAKU_DEF100_2018: as U?#1 on sheet 1; COMPONENTTYPE: 2; COMPONENTKIND: 0; PLOTDATE: YYYY.MM.DD; AUTHOR: cae; UPDATEDATE: 2019/08/29

## Sheet 3.SchDoc
size 420 x 297 mm
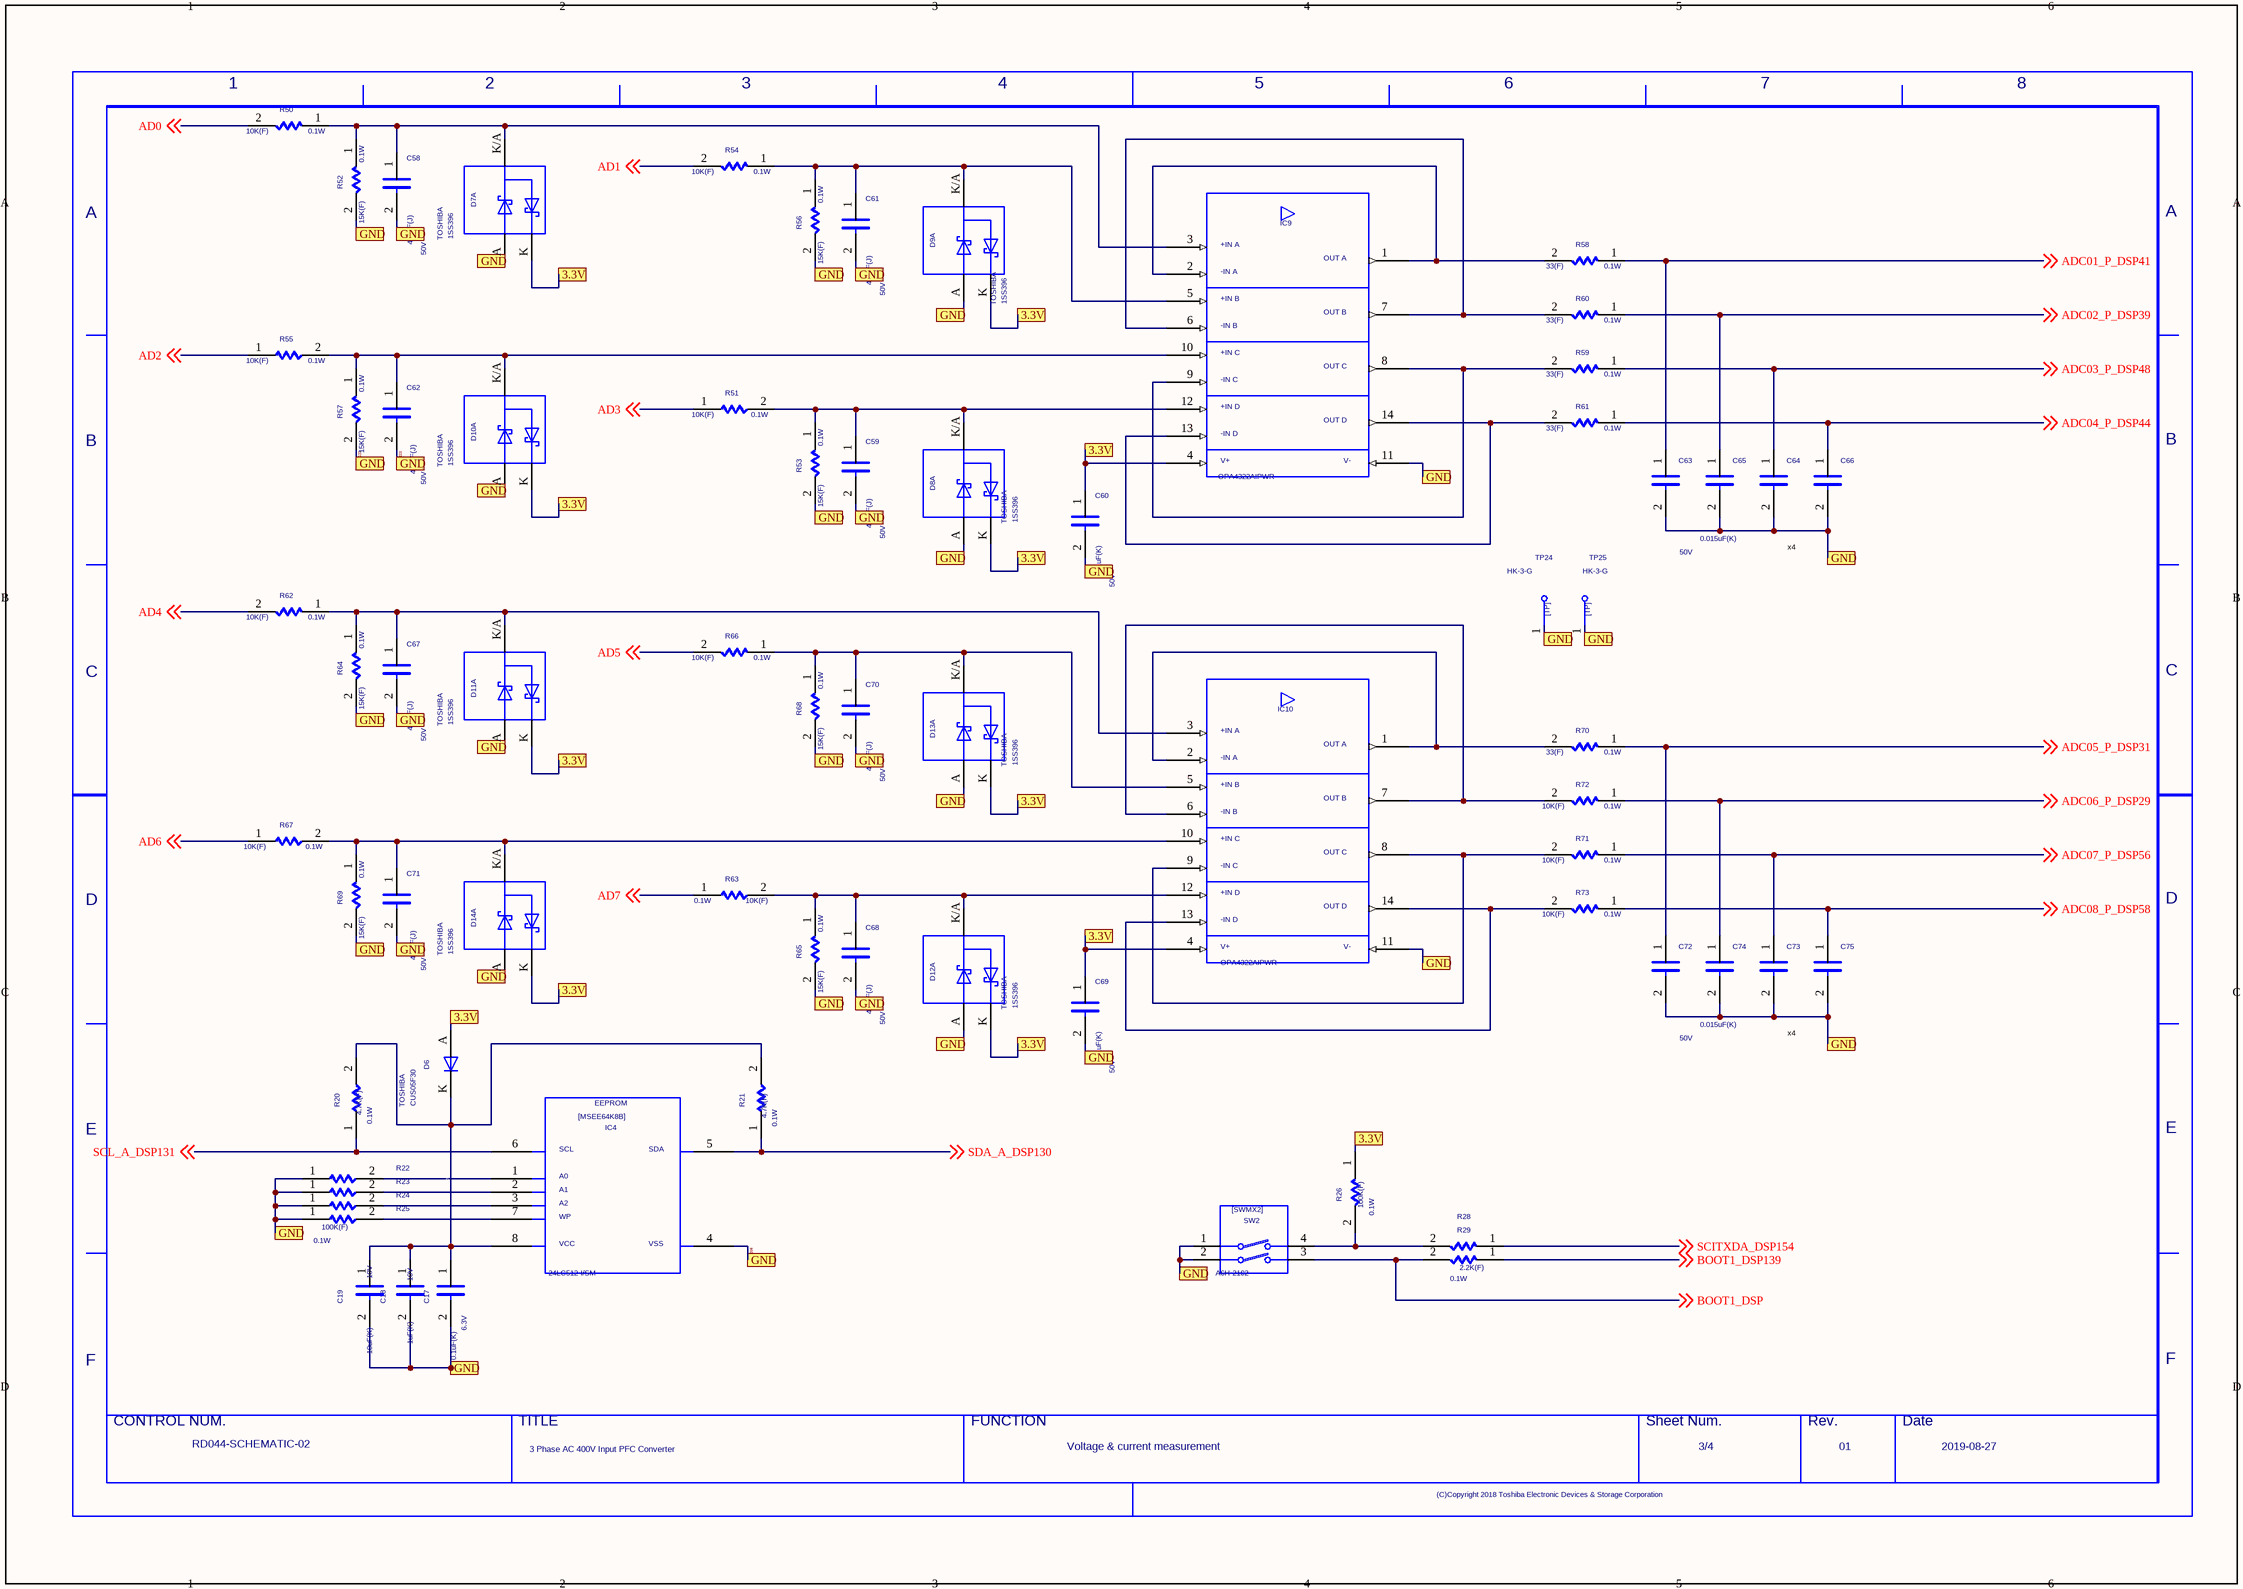
[diagram p2: 3.SchDoc]

### Parts
(Parts that share a designator on the sheet are numbered #1, #2 ... from top to bottom, then left to right.)
C17  VAL2: 6.3V  VAL1: 0.1uF(K)  (hidden comment: C)
C18  VAL2: 10V  VAL1: 1uF(K)  (hidden comment: C)
C19  VAL2: 10V  VAL1: 10uF(K)  (hidden comment: C)
C58  VAL2: 50V  VAL1: 470pF(J)  (hidden comment: C)
C59  VAL2: 50V  VAL1: 470pF(J)  (hidden comment: C)
C60  VAL2: 50V  VAL1: 0.1uF(K)  (hidden comment: C)
C61  VAL2: 50V  VAL1: 470pF(J)  (hidden comment: C)
C62  VAL2: 50V  VAL1: 470pF(J)  (hidden comment: C)
C63  VAL2: 50V  VAL1: 0.015uF(K)  (hidden comment: C)
C64  C  (value not drawn)
C65  C  (value not drawn)
C66  C  (value not drawn)
C67  VAL2: 50V  VAL1: 470pF(J)  (hidden comment: C)
C68  VAL2: 50V  VAL1: 470pF(J)  (hidden comment: C)
C69  VAL2: 50V  VAL1: 0.1uF(K)  (hidden comment: C)
C70  VAL2: 50V  VAL1: 470pF(J)  (hidden comment: C)
C71  VAL2: 50V  VAL1: 470pF(J)  (hidden comment: C)
C72  VAL2: 50V  VAL1: 0.015uF(K)  (hidden comment: C)
C73  C  (value not drawn)
C74  C  (value not drawn)
C75  C  (value not drawn)
D6  USERCOMPTEXT3: TOSHIBA  VAL3: CUS05F30  (hidden comment: DIODE)
D7  USERCOMPTEXT3: TOSHIBA  (hidden comment: 1SS396)  (part A of 3)
D8  USERCOMPTEXT3: TOSHIBA  (hidden comment: 1SS396)  (part A of 3)
D9  USERCOMPTEXT3: TOSHIBA  (hidden comment: 1SS396)  (part A of 3)
D10  USERCOMPTEXT3: TOSHIBA  (hidden comment: 1SS396)  (part A of 3)
D11  USERCOMPTEXT3: TOSHIBA  (hidden comment: 1SS396)  (part A of 3)
D12  USERCOMPTEXT3: TOSHIBA  (hidden comment: 1SS396)  (part A of 3)
D13  USERCOMPTEXT3: TOSHIBA  (hidden comment: 1SS396)  (part A of 3)
D14  USERCOMPTEXT3: TOSHIBA  (hidden comment: 1SS396)  (part A of 3)
IC4  VAL3: 24LC512-I/SM  (hidden comment: MSEE64K8B)
IC9  VAL3: OPA4322AIPWR  (hidden comment: OPA4322A)
IC10  VAL3: OPA4322AIPWR  (hidden comment: OPA4322A)
R20  VAL2: 0.1W  VAL1: 4.7K(F)  (hidden comment: R)
R21  VAL2: 0.1W  VAL1: 4.7K(F)  (hidden comment: R)
R22  R  (value not drawn)
R23  R  (value not drawn)
R24  R  (value not drawn)
R25  VAL2: 0.1W  VAL1: 100K(F)  (hidden comment: R)
R26  VAL2: 0.1W  VAL1: 100K(F)  (hidden comment: R)
R28  R  (value not drawn)
R29  VAL2: 0.1W  VAL1: 2.2K(F)  (hidden comment: R)
R50  VAL2: 0.1W  VAL1: 10K(F)  (hidden comment: R)
R51  VAL2: 0.1W  VAL1: 10K(F)  (hidden comment: R)
R52  VAL2: 0.1W  VAL1: 15K(F)  (hidden comment: R)
R53  VAL2: 0.1W  VAL1: 15K(F)  (hidden comment: R)
R54  VAL2: 0.1W  VAL1: 10K(F)  (hidden comment: R)
R55  VAL2: 0.1W  VAL1: 10K(F)  (hidden comment: R)
R56  VAL2: 0.1W  VAL1: 15K(F)  (hidden comment: R)
R57  VAL2: 0.1W  VAL1: 15K(F)  (hidden comment: R)
R58  VAL2: 0.1W  VAL1: 33(F)  (hidden comment: R)
R59  VAL2: 0.1W  VAL1: 33(F)  (hidden comment: R)
R60  VAL2: 0.1W  VAL1: 33(F)  (hidden comment: R)
R61  VAL2: 0.1W  VAL1: 33(F)  (hidden comment: R)
R62  VAL2: 0.1W  VAL1: 10K(F)  (hidden comment: R)
R63  VAL2: 0.1W  VAL1: 10K(F)  (hidden comment: R)
R64  VAL2: 0.1W  VAL1: 15K(F)  (hidden comment: R)
R65  VAL2: 0.1W  VAL1: 15K(F)  (hidden comment: R)
R66  VAL2: 0.1W  VAL1: 10K(F)  (hidden comment: R)
R67  VAL2: 0.1W  VAL1: 10K(F)  (hidden comment: R)
R68  VAL2: 0.1W  VAL1: 15K(F)  (hidden comment: R)
R69  VAL2: 0.1W  VAL1: 15K(F)  (hidden comment: R)
R70  VAL2: 0.1W  VAL1: 33(F)  (hidden comment: R)
R71  VAL2: 0.1W  VAL1: 10K(F)  (hidden comment: R)
R72  VAL2: 0.1W  VAL1: 10K(F)  (hidden comment: R)
R73  VAL2: 0.1W  VAL1: 10K(F)  (hidden comment: R)
SW2  VAL3: A6H-2102  (hidden comment: SWMX2)
TP24  VAL3: HK-3-G  (hidden comment: TP)
TP25  VAL3: HK-3-G  (hidden comment: TP)
U?#3  DATE: 2019-08-27  REVISION: 01  SHEETNUMBER: 3/4  FUNCTION: Voltage & current measurement  TITLE: 3 Phase AC 400V Input PFC Converter  DRAWINGNUMBER: RD044-SCHEMATIC-02  (hidden comment: WAKU_DEF100_2018)

### Ports
3.3V, GND

### Nets
AD0: R50.2 ; off-sheet AD0
AD1: R54.2 ; off-sheet AD1
AD2: R55.1 ; off-sheet AD2
AD3: R51.1 ; off-sheet AD3
AD4: R62.2 ; off-sheet AD4
AD5: R66.2 ; off-sheet AD5
AD6: R67.1 ; off-sheet AD6
AD7: R63.1 ; off-sheet AD7
ADC01_P_DSP41: C63.1 R58.1 ; off-sheet ADC01_P_DSP41
ADC02_P_DSP39: C65.1 R60.1 ; off-sheet ADC02_P_DSP39
ADC03_P_DSP48: C64.1 R59.1 ; off-sheet ADC03_P_DSP48
ADC04_P_DSP44: C66.1 R61.1 ; off-sheet ADC04_P_DSP44
ADC05_P_DSP31: C72.1 R70.1 ; off-sheet ADC05_P_DSP31
ADC06_P_DSP29: C74.1 R72.1 ; off-sheet ADC06_P_DSP29
ADC07_P_DSP56: C73.1 R71.1 ; off-sheet ADC07_P_DSP56
ADC08_P_DSP58: C75.1 R73.1 ; off-sheet ADC08_P_DSP58
BOOT1_DSP: R29.2 SW2.3 ; off-sheet BOOT1_DSP
BOOT1_DSP139: R29.1 ; off-sheet BOOT1_DSP139
N16610346: C17.1 C18.1 C19.1 D6.K IC4.8 R20.2 R21.2
N16610376: IC4.1 R22.2
N16610420: IC4.2 R23.2
N16610428: IC4.7 R25.2
N16610486: IC4.3 R24.2
N16610930: R26.2 R28.2 SW2.4
N16624647: C59.1 D8.K/A IC9.12 R51.2 R53.1
N16624651: C58.1 D7.K/A IC9.3 R50.1 R52.1
N16624783: IC9.1 IC9.2 R58.2
N16624799: IC9.13 IC9.14 R61.2
N16625013: C61.1 D9.K/A IC9.5 R54.1 R56.1
N16625021: C62.1 D10.K/A IC9.10 R55.2 R57.1
N16625097: IC9.6 IC9.7 R60.2
N16625113: IC9.8 IC9.9 R59.2
N16625873: C67.1 D11.K/A IC10.3 R62.1 R64.1
N16626013: IC10.1 IC10.2 R70.2
N16626029: IC10.13 IC10.14 R73.2
N16626045: C68.1 D12.K/A IC10.12 R63.2 R65.1
N16626273: C70.1 D13.K/A IC10.5 R66.1 R68.1
N16626281: C71.1 D14.K/A IC10.10 R67.2 R69.1
N16626357: IC10.6 IC10.7 R72.2
N16626365: IC10.8 IC10.9 R71.2
SCITXDA_DSP154: R28.1 ; off-sheet SCITXDA_DSP154
SCL_A_DSP131: IC4.6 R20.1 ; off-sheet SCL_A_DSP131
SDA_A_DSP130: IC4.5 R21.1 ; off-sheet SDA_A_DSP130
SIG206: C17.2 C18.2 C19.2 C58.2 C59.2 C60.2 C61.2 C62.2 C63.2 C64.2 C65.2 C66.2 C67.2 C68.2 C69.2 C70.2 C71.2 C72.2 C73.2 C74.2 C75.2 D7.A D8.A D9.A D10.A D11.A D12.A D13.A D14.A IC4.4 IC9.11 IC10.11 R22.1 R23.1 R24.1 R25.1 R52.2 R53.2 R56.2 R57.2 R64.2 R65.2 R68.2 R69.2 SW2.1 SW2.2 TP24.1 TP25.1 ; port GND  [also labelled SIG222, SIG223]
SIG462: C60.1 C69.1 D6.A D7.K D8.K D9.K D10.K D11.K D12.K D13.K D14.K IC9.4 IC10.4 R26.1 ; port 3.3V

### Notes on the sheet
- x4
- (in symbol MSEE64K8B) [MSEE64K8B]; SCL; SDA; A0; A1; A2; WP; VCC; VSS
- (in symbol OPA4322A) +IN A; OUT A; -IN A; +IN B; OUT B; -IN B; +IN C; OUT C; -IN C; +IN D; OUT D; -IN D; V+; V-
- (in symbol SWMX2) [SWMX2]
- (in symbol TP) [TP]
- (in symbol WAKU_DEF100_2018) 1; 3; 5; 6; 7; 8; A; B; C; D; E; F; CONTROL NUM.; TITLE; FUNCTION; Sheet Num.; Rev.; Date; (C)Copyright 2018 Toshiba Electronic Devices & Storage Corporation

### Library data of the parts
C17 = C: as C1 on sheet 1; COMPONENTTYPE: 4; COMPONENTKIND: 108
C18 = C: as C8 on sheet 1; COMPONENTTYPE: 4; COMPONENTKIND: 108
C19 = C: PARTNAME: C-GRM188R61A106KE69D; OriginalSymbolOrigin: (2540,7620); USERCOMPTEXT1: 1608; COMPONENTTYPE: 4; COMPONENTKIND: 108
C58 C59 C61 C62 C67 C68 C70 C71 = C: PARTNAME: C-GRM1885C1H471JA01D; OriginalSymbolOrigin: (2540,7620); USERCOMPTEXT1: 1608; COMPONENTTYPE: 4; COMPONENTKIND: 108
C60 C69 = C: as C54 on sheet 2; COMPONENTTYPE: 4; COMPONENTKIND: 108
C63 C72 = C: PARTNAME: C-GRM188R11H153KA01D; OriginalSymbolOrigin: (2540,7620); USERCOMPTEXT1: 1608; COMPONENTTYPE: 4; COMPONENTKIND: 108
C64-C66 C73-C75 = C: PARTNAME: C-GRM188R11H153KA01D; OriginalSymbolOrigin: (2540,7620); USERCOMPTEXT1: 1608; VAL2: 50V; VAL1: 0.015uF(K); COMPONENTTYPE: 4; COMPONENTKIND: 108
D6 = DIODE: PARTNAME: D-CUS05F30; SAVEAREA0: -1337,-97,13924,7829; SAVECOUNT: 4; TIME: 14:49:55; UPDATEUSER: cae; UPDATETIME: 13:41:08; OriginalSymbolOrigin: (5080,5080); COMPONENTTYPE: 4; COMPONENTKIND: 103; AUTHOR: ikeda-k; DATE: 2003/02/07; UPDATEDATE: 2019/07/08
D7-D14 = 1SS396: as D1 on sheet 1; COMPONENTTYPE: 4; COMPONENTKIND: 103; AUTHOR: sato-yr; DATE: 2002/11/26; UPDATEDATE: 2019/08/02; VAL3: 1SS396
IC4 = MSEE64K8B: PARTNAME: IC-24LC512-I_SM; OUMEPARTTYPE: IC; SAVECOUNT: 8; SAVEAREA0: -9998,-458,55119,39162; TIME: 10:18:07; UPDATEUSER: 19990028; UPDATETIME: 09:15:23; OriginalSymbolOrigin: (7620,35560); MAXGCOUNT: 1; ACCESSTIME: 0; OUMEMAKER: MCT マイクロチップテクノロジー; MOUNTINGFORMSMD: SMD; FNLEADFREETHET1GT2GMCTH1: N_N_N; OUMECLASSIFICATION: メモリ; ADSCNVFLAG: ON; MEMORYCAPACITY: 512K; CDMASTERCADCELG: I8112C; KIND: EEPROM; COMPONENTTYPE: 4; COMPONENTKIND: 101; AUTHOR: 19910145; DATE: 2008/10/07; UPDATEDATE: 2011/01/31; GCOUNT: 1; MAXCLOCKFREQ: 0; OUMEMAKERKATAMEI: 24LC512-I/SM; VAL1: 24LC512-I/SM
IC9 IC10 = OPA4322A: PARTNAME: IC-OPA4322AIPWR; SAVECOUNT: 28; SAVEAREA0: -34439,-609,80338,59004; TIME: 15:40:02; UPDATEUSER: cae; UPDATETIME: 16:49:13; OriginalSymbolOrigin: (7620,55880); COMPONENTTYPE: 4; COMPONENTKIND: 101; AUTHOR: Administrator; DATE: 2002/05/27; UPDATEDATE: 2019/06/25
R20 R21 = R: as R1 on sheet 1; COMPONENTTYPE: 4; COMPONENTKIND: 105
R22-R24 = R: PARTNAME: R-ERJ3EKF1003V; OriginalSymbolOrigin: (5080,5080); USERCOMPTEXT1: 1608; VAL2: 0.1W; VAL1: 100K(F); COMPONENTTYPE: 4; COMPONENTKIND: 105
R25 R26 = R: as R3 on sheet 1; COMPONENTTYPE: 4; COMPONENTKIND: 105
R28 = R: PARTNAME: R-ERJ3EKF2201V; OriginalSymbolOrigin: (5080,5080); USERCOMPTEXT1: 1608; VAL2: 0.1W; VAL1: 2.2K(F); COMPONENTTYPE: 4; COMPONENTKIND: 105
R29 = R: as R14 on sheet 1; COMPONENTTYPE: 4; COMPONENTKIND: 105
R50 R51 R54 R55 R62 R63 R66 R67 = R: as R5 on sheet 1; COMPONENTTYPE: 4; COMPONENTKIND: 105
R52 R53 R56 R57 R64 R65 R68 R69 = R: PARTNAME: R-ERJ3EKF1502V; OriginalSymbolOrigin: (5080,5080); USERCOMPTEXT1: 1608; COMPONENTTYPE: 4; COMPONENTKIND: 105
R58-R61 R70-R73 = R: PARTNAME: R-ERJ3EKF33R0V; OriginalSymbolOrigin: (5080,5080); USERCOMPTEXT1: 1608; COMPONENTTYPE: 4; COMPONENTKIND: 105
SW2 = SWMX2: PARTNAME: SW-A6H-2102; OriginalSymbolOrigin: (5080,15240); COMPONENTTYPE: 4; COMPONENTKIND: 115
TP24 TP25 = TP: as TP2 on sheet 2; COMPONENTTYPE: 4; COMPONENTKIND: 128; AUTHOR: fukuda-y; DATE: 2006/10/04; UPDATEDATE: 2006/10/04
U?#3 = WAKU_DEF100_2018: as U?#1 on sheet 1; COMPONENTTYPE: 2; COMPONENTKIND: 0; PLOTDATE: YYYY.MM.DD; AUTHOR: cae; UPDATEDATE: 2019/08/29

## Sheet 4.SchDoc
size 420 x 297 mm
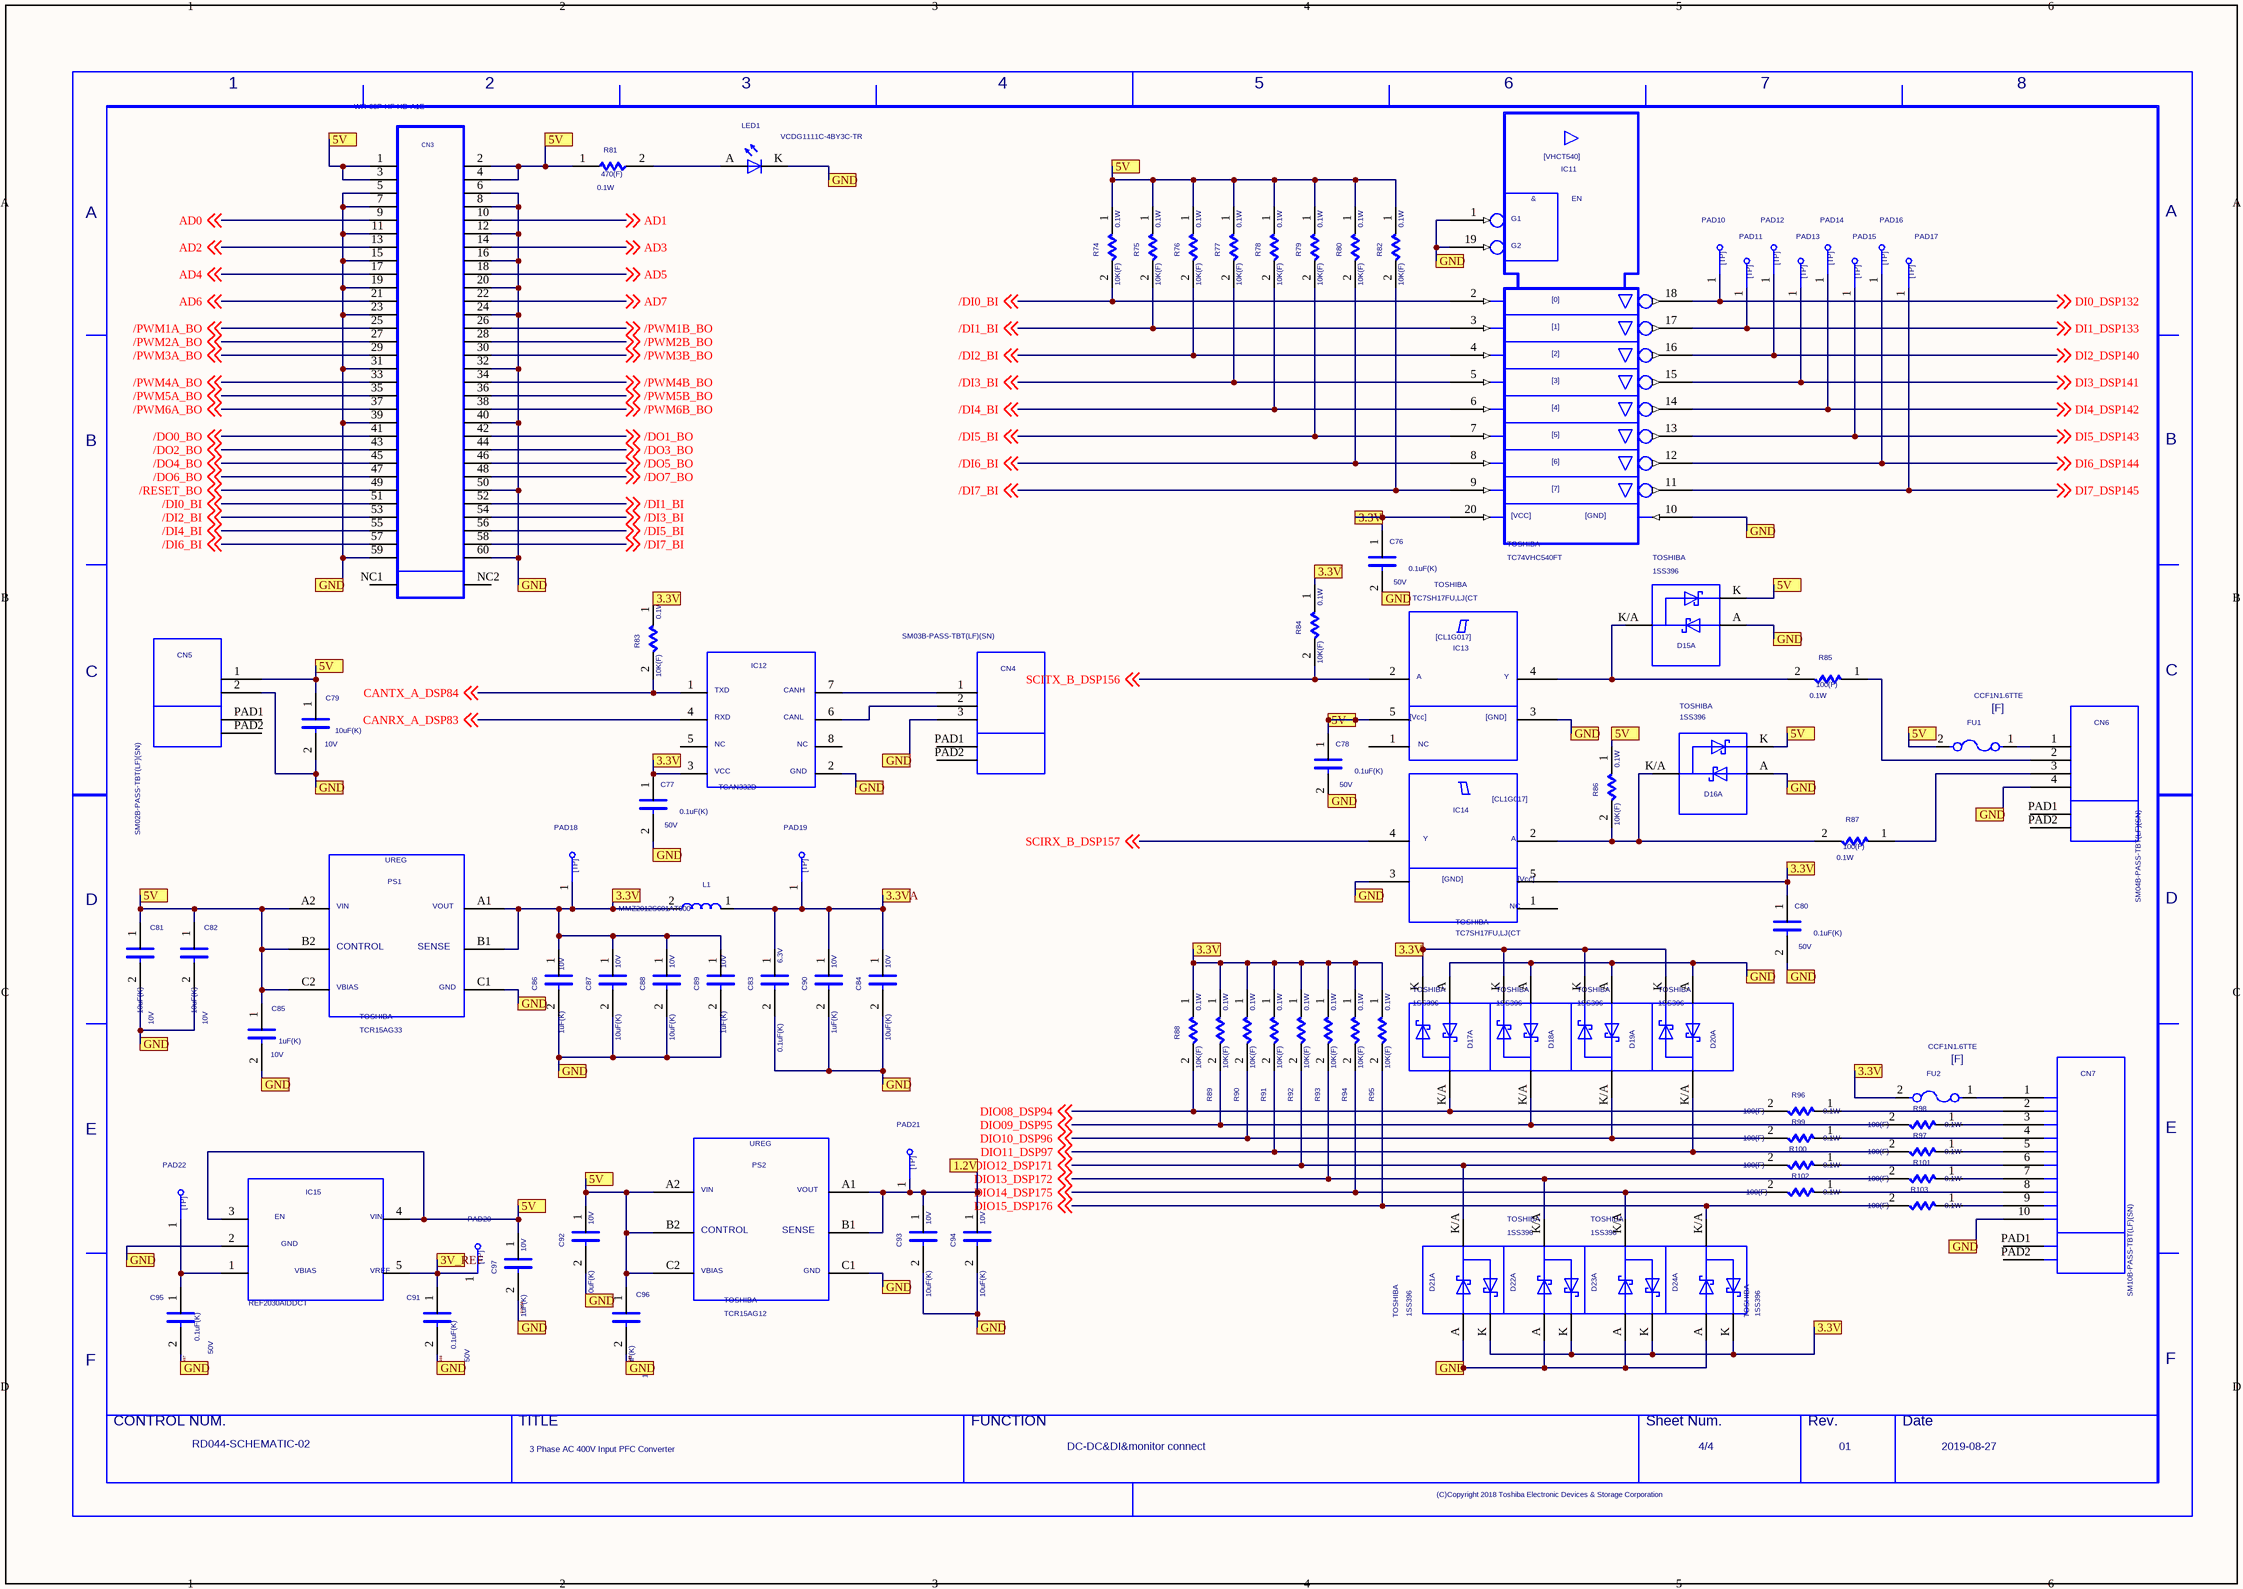
[diagram p3: 4.SchDoc]

### Parts
(Parts that share a designator on the sheet are numbered #1, #2 ... from top to bottom, then left to right.)
C76  VAL2: 50V  VAL1: 0.1uF(K)  (hidden comment: C)
C77  VAL2: 50V  VAL1: 0.1uF(K)  (hidden comment: C)
C78  VAL2: 50V  VAL1: 0.1uF(K)  (hidden comment: C)
C79  VAL2: 10V  VAL1: 10uF(K)  (hidden comment: C)
C80  VAL2: 50V  VAL1: 0.1uF(K)  (hidden comment: C)
C81  VAL2: 10V  VAL1: 10uF(K)  (hidden comment: C)
C82  VAL2: 10V  VAL1: 10uF(K)  (hidden comment: C)
C83  VAL2: 6.3V  VAL1: 0.1uF(K)  (hidden comment: C)
C84  VAL2: 10V  VAL1: 10uF(K)  (hidden comment: C)
C85  VAL2: 10V  VAL1: 1uF(K)  (hidden comment: C)
C86  VAL2: 10V  VAL1: 1uF(K)  (hidden comment: C)
C87  VAL2: 10V  VAL1: 10uF(K)  (hidden comment: C)
C88  VAL2: 10V  VAL1: 10uF(K)  (hidden comment: C)
C89  VAL2: 10V  VAL1: 1uF(K)  (hidden comment: C)
C90  VAL2: 10V  VAL1: 1uF(K)  (hidden comment: C)
C91  VAL2: 50V  VAL1: 0.1uF(K)  (hidden comment: C)
C92  VAL2: 10V  VAL1: 10uF(K)  (hidden comment: C)
C93  VAL2: 10V  VAL1: 10uF(K)  (hidden comment: C)
C94  VAL2: 10V  VAL1: 10uF(K)  (hidden comment: C)
C95  VAL2: 50V  VAL1: 0.1uF(K)  (hidden comment: C)
C96  VAL2: 10V  VAL1: 1uF(K)  (hidden comment: C)
C97  VAL2: 10V  VAL1: 1uF(K)  (hidden comment: C)
CN3  VAL3: WR-60P-HF-HD-A1E  (hidden comment: WR-60P)
CN4  VAL3: SM03B-PASS-TBT(LF)(SN)  (hidden comment: BM03B-PASS)
CN5  VAL3: SM02B-PASS-TBT(LF)(SN)  (hidden comment: BM02B-PASS)
CN6  VAL3: SM04B-PASS-TBT(LF)(SN)  (hidden comment: BM04B-PASS)
CN7  VAL3: SM10B-PASS-TBT(LF)(SN)  (hidden comment: SM10B-PASS)
D15  USERCOMPTEXT3: TOSHIBA  (hidden comment: 1SS396)  (part A of 3)
D16  USERCOMPTEXT3: TOSHIBA  (hidden comment: 1SS396)  (part A of 3)
D17  USERCOMPTEXT3: TOSHIBA  (hidden comment: 1SS396)  (part A of 3)
D18  USERCOMPTEXT3: TOSHIBA  (hidden comment: 1SS396)  (part A of 3)
D19  USERCOMPTEXT3: TOSHIBA  (hidden comment: 1SS396)  (part A of 3)
D20  USERCOMPTEXT3: TOSHIBA  (hidden comment: 1SS396)  (part A of 3)
D21  USERCOMPTEXT3: TOSHIBA  (hidden comment: 1SS396)  (part A of 3)
D22  USERCOMPTEXT3: TOSHIBA  (hidden comment: 1SS396)  (part A of 3)
D23  USERCOMPTEXT3: TOSHIBA  (hidden comment: 1SS396)  (part A of 3)
D24  USERCOMPTEXT3: TOSHIBA  (hidden comment: 1SS396)  (part A of 3)
FU1  VAL3: CCF1N1.6TTE  (hidden comment: F)
FU2  VAL3: CCF1N1.6TTE  (hidden comment: F)
IC11  USERCOMPTEXT3: TOSHIBA  VAL3: TC74VHC540FT  (hidden comment: VHC540)
IC12  TCAN332D
IC13  USERCOMPTEXT3: TOSHIBA  VAL3: TC7SH17FU,LJ(CT  (hidden comment: CL1G017)
IC14  USERCOMPTEXT3: TOSHIBA  VAL3: TC7SH17FU,LJ(CT  (hidden comment: CL1G017)
IC15  VAL3: REF2030AIDDCT  (hidden comment: REF)
L1  VAL3: MMZ2012S601AT000  (hidden comment: L)
LED1  VAL3: VCDG1111C-4BY3C-TR  (hidden comment: VCDG1111C)
PAD10  TP  (value not drawn)
PAD11  TP  (value not drawn)
PAD12  TP  (value not drawn)
PAD13  TP  (value not drawn)
PAD14  TP  (value not drawn)
PAD15  TP  (value not drawn)
PAD16  TP  (value not drawn)
PAD17  TP  (value not drawn)
PAD18  TP  (value not drawn)
PAD19  TP  (value not drawn)
PAD20  TP  (value not drawn)
PAD21  TP  (value not drawn)
PAD22  TP  (value not drawn)
PS1  USERCOMPTEXT3: TOSHIBA  VAL3: TCR15AG33  (hidden comment: L15AG)
PS2  USERCOMPTEXT3: TOSHIBA  VAL3: TCR15AG12  (hidden comment: L15AG)
R74  VAL2: 0.1W  VAL1: 10K(F)  (hidden comment: R)
R75  VAL2: 0.1W  VAL1: 10K(F)  (hidden comment: R)
R76  VAL2: 0.1W  VAL1: 10K(F)  (hidden comment: R)
R77  VAL2: 0.1W  VAL1: 10K(F)  (hidden comment: R)
R78  VAL2: 0.1W  VAL1: 10K(F)  (hidden comment: R)
R79  VAL2: 0.1W  VAL1: 10K(F)  (hidden comment: R)
R80  VAL2: 0.1W  VAL1: 10K(F)  (hidden comment: R)
R81  VAL2: 0.1W  VAL1: 470(F)  (hidden comment: R)
R82  VAL2: 0.1W  VAL1: 10K(F)  (hidden comment: R)
R83  VAL2: 0.1W  VAL1: 10K(F)  (hidden comment: R)
R84  VAL2: 0.1W  VAL1: 10K(F)  (hidden comment: R)
R85  VAL2: 0.1W  VAL1: 100(F)  (hidden comment: R)
R86  VAL2: 0.1W  VAL1: 10K(F)  (hidden comment: R)
R87  VAL2: 0.1W  VAL1: 100(F)  (hidden comment: R)
R88  VAL2: 0.1W  VAL1: 10K(F)  (hidden comment: R)
R89  VAL2: 0.1W  VAL1: 10K(F)  (hidden comment: R)
R90  VAL2: 0.1W  VAL1: 10K(F)  (hidden comment: R)
R91  VAL2: 0.1W  VAL1: 10K(F)  (hidden comment: R)
R92  VAL2: 0.1W  VAL1: 10K(F)  (hidden comment: R)
R93  VAL2: 0.1W  VAL1: 10K(F)  (hidden comment: R)
R94  VAL2: 0.1W  VAL1: 10K(F)  (hidden comment: R)
R95  VAL2: 0.1W  VAL1: 10K(F)  (hidden comment: R)
R96  VAL2: 0.1W  VAL1: 100(F)  (hidden comment: R)
R97  VAL2: 0.1W  VAL1: 100(F)  (hidden comment: R)
R98  VAL2: 0.1W  VAL1: 100(F)  (hidden comment: R)
R99  VAL2: 0.1W  VAL1: 100(F)  (hidden comment: R)
R100  VAL2: 0.1W  VAL1: 100(F)  (hidden comment: R)
R101  VAL2: 0.1W  VAL1: 100(F)  (hidden comment: R)
R102  VAL2: 0.1W  VAL1: 100(F)  (hidden comment: R)
R103  VAL2: 0.1W  VAL1: 100(F)  (hidden comment: R)
U?#4  DATE: 2019-08-27  REVISION: 01  SHEETNUMBER: 4/4  FUNCTION: DC-DC&DI&monitor connect  TITLE: 3 Phase AC 400V Input PFC Converter  DRAWINGNUMBER: RD044-SCHEMATIC-02  (hidden comment: WAKU_DEF100_2018)

### Ports
1.2V, 3.3V, 3.3VA, 3V_REF, 5V, GND

### Nets
/DI0_BI: CN3.51 IC11.2 R74.2 ; off-sheet /DI0_BI
/DI1_BI: CN3.52 IC11.3 R75.2 ; off-sheet /DI1_BI
/DI2_BI: CN3.53 IC11.4 R76.2 ; off-sheet /DI2_BI
/DI3_BI: CN3.54 IC11.5 R77.2 ; off-sheet /DI3_BI
/DI4_BI: CN3.55 IC11.6 R78.2 ; off-sheet /DI4_BI
/DI5_BI: CN3.56 IC11.7 R79.2 ; off-sheet /DI5_BI
/DI6_BI: CN3.57 IC11.8 R80.2 ; off-sheet /DI6_BI
/DI7_BI: CN3.58 IC11.9 R82.2 ; off-sheet /DI7_BI
/DO0_BO: CN3.41 ; off-sheet /DO0_BO
/DO1_BO: CN3.42 ; off-sheet /DO1_BO
/DO2_BO: CN3.43 ; off-sheet /DO2_BO
/DO3_BO: CN3.44 ; off-sheet /DO3_BO
/DO4_BO: CN3.45 ; off-sheet /DO4_BO
/DO5_BO: CN3.46 ; off-sheet /DO5_BO
/DO6_BO: CN3.47 ; off-sheet /DO6_BO
/DO7_BO: CN3.48 ; off-sheet /DO7_BO
/PWM1A_BO: CN3.25 ; off-sheet /PWM1A_BO
/PWM1B_BO: CN3.26 ; off-sheet /PWM1B_BO
/PWM2A_BO: CN3.27 ; off-sheet /PWM2A_BO
/PWM2B_BO: CN3.28 ; off-sheet /PWM2B_BO
/PWM3A_BO: CN3.29 ; off-sheet /PWM3A_BO
/PWM3B_BO: CN3.30 ; off-sheet /PWM3B_BO
/PWM4A_BO: CN3.33 ; off-sheet /PWM4A_BO
/PWM4B_BO: CN3.34 ; off-sheet /PWM4B_BO
/PWM5A_BO: CN3.35 ; off-sheet /PWM5A_BO
/PWM5B_BO: CN3.36 ; off-sheet /PWM5B_BO
/PWM6A_BO: CN3.37 ; off-sheet /PWM6A_BO
/PWM6B_BO: CN3.38 ; off-sheet /PWM6B_BO
/RESET_BO: CN3.49 ; off-sheet /RESET_BO
AD0: CN3.9 ; off-sheet AD0
AD1: CN3.10 ; off-sheet AD1
AD2: CN3.13 ; off-sheet AD2
AD3: CN3.14 ; off-sheet AD3
AD4: CN3.17 ; off-sheet AD4
AD5: CN3.18 ; off-sheet AD5
AD6: CN3.21 ; off-sheet AD6
AD7: CN3.22 ; off-sheet AD7
CANRX_A_DSP83: IC12.4 ; off-sheet CANRX_A_DSP83
CANTX_A_DSP84: IC12.1 R83.2 ; off-sheet CANTX_A_DSP84
DI0_DSP132: IC11.18 PAD10.1 ; off-sheet DI0_DSP132
DI1_DSP133: IC11.17 PAD11.1 ; off-sheet DI1_DSP133
DI2_DSP140: IC11.16 PAD12.1 ; off-sheet DI2_DSP140
DI3_DSP141: IC11.15 PAD13.1 ; off-sheet DI3_DSP141
DI4_DSP142: IC11.14 PAD14.1 ; off-sheet DI4_DSP142
DI5_DSP143: IC11.13 PAD15.1 ; off-sheet DI5_DSP143
DI6_DSP144: IC11.12 PAD16.1 ; off-sheet DI6_DSP144
DI7_DSP145: IC11.11 PAD17.1 ; off-sheet DI7_DSP145
DIO08_DSP94: D17.K/A R88.2 R96.2 ; off-sheet DIO08_DSP94
DIO09_DSP95: D18.K/A R89.2 R98.2 ; off-sheet DIO09_DSP95
DIO10_DSP96: D19.K/A R90.2 R99.2 ; off-sheet DIO10_DSP96
DIO11_DSP97: D20.K/A R91.2 R97.2 ; off-sheet DIO11_DSP97
DIO12_DSP171: D21.K/A R92.2 R100.2 ; off-sheet DIO12_DSP171
DIO13_DSP172: D22.K/A R93.2 R101.2 ; off-sheet DIO13_DSP172
DIO14_DSP175: D23.K/A R94.2 R102.2 ; off-sheet DIO14_DSP175
DIO15_DSP176: D24.K/A R95.2 R103.2 ; off-sheet DIO15_DSP176
N16642513: C95.1 IC15.1 PAD22.1
N16664780: D15.K/A IC13.4 R85.2
N16668564: D16.K/A IC14.2 R86.2 R87.2
N16668568: CN6.3 R87.1
N16669496: CN4.1 IC12.7
N16669500: CN4.2 IC12.6
N16671270: CN6.2 R85.1
N16690596: LED1.A R81.2
N16817849: CN7.9 R103.1
N16817854: CN7.8 R102.1
N16817859: CN7.7 R101.1
N16817864: CN7.6 R100.1
N16817869: CN7.5 R97.1
N16817874: CN7.4 R99.1
N16817879: CN7.3 R98.1
N16817884: CN7.2 R96.1
N16840741: CN7.1 FU2.1
N16841842: CN6.1 FU1.1
SCIRX_B_DSP157: IC14.4 ; off-sheet SCIRX_B_DSP157
SCITX_B_DSP156: IC13.2 R84.2 ; off-sheet SCITX_B_DSP156
SIG462: C76.1 C77.1 C80.1 C86.1 C87.1 C88.1 C89.1 D17.K D18.K D19.K D20.K D21.K D22.K D23.K D24.K FU2.2 IC11.20 IC12.3 IC14.5 L1.2 PAD18.1 PS1.A1 PS1.B1 R83.1 R84.1 R88.1 R89.1 R90.1 R91.1 R92.1 R93.1 R94.1 R95.1 ; port 3.3V
SIG466: C76.2 C77.2 C78.2 C79.2 C80.2 C81.2 C82.2 C83.2 C84.2 C85.2 C86.2 C87.2 C88.2 C89.2 C90.2 C91.2 C92.2 C93.2 C94.2 C95.2 C96.2 C97.2 CN3.5 CN3.6 CN3.7 CN3.8 CN3.11 CN3.12 CN3.15 CN3.16 CN3.19 CN3.20 CN3.23 CN3.24 CN3.31 CN3.32 CN3.39 CN3.40 CN3.50 CN3.59 CN3.60 CN4.3 CN5.2 CN6.4 CN7.10 D15.A D16.A D17.A D18.A D19.A D20.A D21.A D22.A D23.A D24.A IC11.1 IC11.10 IC11.19 IC12.2 IC13.3 IC14.3 IC15.2 LED1.K PS1.C1 PS2.C1 ; port GND  [also labelled SIG467, SIG468, SIG469]  [project net SIG206]
NetC8_1: C83.1 C84.1 C90.1 L1.1 PAD19.1 ; port 3.3VA
NetC10_1: C91.1 IC15.5 PAD20.1 ; port 3V_REF
NetC20_1: C93.1 C94.1 PAD21.1 PS2.A1 PS2.B1 ; port 1.2V
NetC54_1: C78.1 C79.1 C81.1 C82.1 C85.1 C92.1 C96.1 C97.1 CN3.1 CN3.2 CN3.3 CN3.4 CN5.1 D15.K D16.K FU1.2 IC13.5 IC15.3 IC15.4 PS1.A2 PS1.B2 PS1.C2 PS2.A2 PS2.B2 PS2.C2 R74.1 R75.1 R76.1 R77.1 R78.1 R79.1 R80.1 R81.1 R82.1 R86.1 ; port 5V

Not connected (* = marked no-connect by the designer): CN3 NC1 NC2; CN4 PAD1 PAD2; CN5 PAD1 PAD2; CN6 PAD1 PAD2; CN7 PAD1 PAD2; IC12 5 8; IC13 1; IC14 1

### Notes on the sheet
- (in symbol CL1G017) [CL1G017]; A; Y; [Vcc]; [GND]; NC
- (in symbol F) [F]
- (in symbol L15AG) UREG; VIN; VOUT; CONTROL; SENSE; VBIAS; GND
- (in symbol REF) EN; VIN; GND; VBIAS; VREF
- (in symbol TCAN332D) TXD; CANH; RXD; CANL; NC; VCC; GND
- (in symbol TP) [TP]
- (in symbol VHC540) [VHCT540]; &; EN; G1; G2; [0]; [1]; [2]; [3]; [4]; [5]; [6]; [7]; [VCC]; [GND]
- (in symbol WAKU_DEF100_2018) 1; 3; 5; 6; 7; 8; A; B; C; D; E; F; CONTROL NUM.; TITLE; FUNCTION; Sheet Num.; Rev.; Date; (C)Copyright 2018 Toshiba Electronic Devices & Storage Corporation

### Library data of the parts
C76-C78 C80 C91 C95 = C: as C54 on sheet 2; COMPONENTTYPE: 4; COMPONENTKIND: 108
C79 C81 C82 C84 C87 C88 C92-C94 = C: as C19 on sheet 3; COMPONENTTYPE: 4; COMPONENTKIND: 108
C83 = C: as C1 on sheet 1; COMPONENTTYPE: 4; COMPONENTKIND: 108
C85 C86 C89 C90 C96 C97 = C: as C8 on sheet 1; COMPONENTTYPE: 4; COMPONENTKIND: 108
CN3 = WR-60P: PARTNAME: CN-WR-60P-HF-HD-A1E; SAVEAREA0: -67682,-998,88845,96631; SAVECOUNT: 3; TIME: 09:42:27; UPDATEUSER: cae; UPDATETIME: 10:25:54; OriginalSymbolOrigin: (5080,91440); COMPONENTTYPE: 4; COMPONENTKIND: 111; AUTHOR: cae; DATE: 2019/07/05; UPDATEDATE: 2019/08/02
CN4 = BM03B-PASS: PARTNAME: CN-SM03B-PASS-TBT_LF_SN; SAVEAREA0: -16737,-296,39143,28727; SAVECOUNT: 24; TIME: 13:28:28; UPDATEUSER: cae; UPDATETIME: 10:14:21; OriginalSymbolOrigin: (2540,25400); COMPONENTTYPE: 4; COMPONENTKIND: 135; AUTHOR: user1; DATE: 2004/01/19; UPDATEDATE: 2019/06/25
CN5 = BM02B-PASS: PARTNAME: CN-SM02B-PASS-TBT_LF_SN; SAVEAREA0: -14164,-269,36638,26116; SAVECOUNT: 26; TIME: 13:28:28; UPDATEUSER: cae; UPDATETIME: 10:15:00; OriginalSymbolOrigin: (2540,22860); COMPONENTTYPE: 4; COMPONENTKIND: 135; AUTHOR: user1; DATE: 2004/01/19; UPDATEDATE: 2019/06/25
CN6 = BM04B-PASS: PARTNAME: CN-SM04B-PASS-TBT_LF_SN; SAVEAREA0: -19295,-323,41666,31339; SAVECOUNT: 22; TIME: 13:28:28; UPDATEUSER: cae; UPDATETIME: 10:17:11; OriginalSymbolOrigin: (2540,27940); COMPONENTTYPE: 4; COMPONENTKIND: 135; AUTHOR: user1; DATE: 2004/01/19; UPDATEDATE: 2019/06/25
CN7 = SM10B-PASS: PARTNAME: CN-SM10B-PASS-TBT_LF_SN; SAVEAREA0: -33411,-485,58033,47009; SAVECOUNT: 23; TIME: 13:28:28; UPDATEUSER: cae; UPDATETIME: 14:27:01; OriginalSymbolOrigin: (2540,43180); COMPONENTTYPE: 4; COMPONENTKIND: 135; AUTHOR: user1; DATE: 2004/01/19; UPDATEDATE: 2019/07/22
D15-D24 = 1SS396: as D1 on sheet 1; COMPONENTTYPE: 4; COMPONENTKIND: 103; AUTHOR: sato-yr; DATE: 2002/11/26; UPDATEDATE: 2019/08/02; VAL3: 1SS396
FU1 FU2 = F: PARTNAME: FU-CCF1N1.6TTE; OriginalSymbolOrigin: (2540,5080); COMPONENTTYPE: 4; COMPONENTKIND: 119
IC11 = VHC540: PARTNAME: IC-TC74VHC540FT; SAVEAREA0: -64373,-927,110287,89788; TIME: 09:37:32; UPDATEUSER: cae; SAVECOUNT: 1; OriginalSymbolOrigin: (7620,83820); COMPONENTTYPE: 4; COMPONENTKIND: 101; AUTHOR: cae; DATE: 2019/07/12; UPDATEDATE: 2019/07/12; UPDATETIME: 09:37:32
IC12 = TCAN332D: PARTNAME: IC-TCAN332D; SAVECOUNT: 26; SAVEAREA0: -15475,-323,45487,31339; TIME: 17:47:02; UPDATEUSER: cae; UPDATETIME: 14:38:54; OriginalSymbolOrigin: (5080,27940); COMPONENTTYPE: 4; COMPONENTKIND: 101; AUTHOR: omeh0432; DATE: 2003/04/15; UPDATEDATE: 2019/07/22; VAL3: TCAN332D
IC13 IC14 = CL1G017: as IC8 on sheet 2; COMPONENTTYPE: 4; COMPONENTKIND: 101; AUTHOR: e2117910; DATE: 2003/02/06; UPDATEDATE: 2004/03/26; GCOUNT: 1; OUMEMAKERKATAMEI: TC7SH17FU,LJ(CT; VAL1: TC7SH17FU,LJ(CT
IC15 = REF: PARTNAME: IC-REF2030AIDDCT; SAVECOUNT: 25; SAVEAREA0: -10386,-296,45494,28727; TIME: 17:47:02; UPDATEUSER: cae; UPDATETIME: 11:05:59; OriginalSymbolOrigin: (5080,25400); COMPONENTTYPE: 4; COMPONENTKIND: 101; AUTHOR: omeh0432; DATE: 2003/04/15; UPDATEDATE: 2019/06/25
L1 = L: PARTNAME: L-MMZ2012S601AT000; OriginalSymbolOrigin: (2540,5080); COMPONENTTYPE: 4; COMPONENTKIND: 117
LED1 = VCDG1111C: PARTNAME: LED-VCDG1111C-4BY3C-TR; SAVEAREA0: -6769,-859,19276,16321; TIME: 14:49:55; UPDATEUSER: cae; UPDATETIME: 10:51:12; SAVECOUNT: 5; OriginalSymbolOrigin: (5080,7620); COMPONENTTYPE: 4; COMPONENTKIND: 104; AUTHOR: ikeda-k; DATE: 2003/02/07; UPDATEDATE: 2019/08/02
PAD10 PAD18-PAD22 = TP: as PAD1 on sheet 2; COMPONENTTYPE: 4; COMPONENTKIND: 128; AUTHOR: fukuda-y; DATE: 2006/10/04; UPDATEDATE: 2006/10/04
PAD11-PAD17 = TP: as PAD2 on sheet 2; COMPONENTTYPE: 4; COMPONENTKIND: 128; AUTHOR: fukuda-y; DATE: 2006/10/04; UPDATEDATE: 2006/10/04
PS1 = L15AG: PARTNAME: PS-TCR15AG33; TIME: 08:44:39; UPDATEUSER: cae; UPDATETIME: 13:17:54; SAVECOUNT: 102; SAVEAREA0: -14581,-371,55282,35914; OriginalSymbolOrigin: (7620,33020); COMPONENTTYPE: 4; COMPONENTKIND: 101; AUTHOR: utauser; DATE: 2002/12/27; UPDATEDATE: 2019/07/22
PS2 = L15AG: PARTNAME: PS-TCR15AG12; TIME: 08:44:39; UPDATEUSER: cae; UPDATETIME: 13:17:54; SAVECOUNT: 102; SAVEAREA0: -14581,-371,55282,35914; OriginalSymbolOrigin: (7620,33020); COMPONENTTYPE: 4; COMPONENTKIND: 101; AUTHOR: utauser; DATE: 2002/12/27; UPDATEDATE: 2019/07/22
R74-R80 R82-R84 R86 R88-R95 = R: as R5 on sheet 1; COMPONENTTYPE: 4; COMPONENTKIND: 105
R81 = R: PARTNAME: R-ERJ3EKF4700V; OriginalSymbolOrigin: (5080,5080); USERCOMPTEXT1: 1608; COMPONENTTYPE: 4; COMPONENTKIND: 105
R85 R87 R96-R103 = R: as R11 on sheet 1; COMPONENTTYPE: 4; COMPONENTKIND: 105
U?#4 = WAKU_DEF100_2018: as U?#1 on sheet 1; COMPONENTTYPE: 2; COMPONENTKIND: 0; PLOTDATE: YYYY.MM.DD; AUTHOR: cae; UPDATEDATE: 2019/08/29

## Nets that join several sheets
/DO0_BO: 2 (IC7.11 PAD8.1), 4 (CN3.41)
/DO1_BO: 2 (IC7.12 PAD7.1), 4 (CN3.42)
/DO2_BO: 2 (IC7.13 PAD6.1), 4 (CN3.43)
/DO3_BO: 2 (IC7.14 PAD5.1), 4 (CN3.44)
/DO4_BO: 2 (IC7.15 PAD4.1), 4 (CN3.45)
/DO5_BO: 2 (IC7.16 PAD3.1), 4 (CN3.46)
/DO6_BO: 2 (IC7.17 PAD2.1), 4 (CN3.47)
/DO7_BO: 2 (IC7.18 PAD1.1), 4 (CN3.48)
/PWM1A_BO: 2 (IC5.13 TP6.1), 4 (CN3.25)
/PWM1B_BO: 2 (IC5.14 TP5.1), 4 (CN3.26)
/PWM2A_BO: 2 (IC5.15 TP4.1), 4 (CN3.27)
/PWM2B_BO: 2 (IC5.16 TP3.1), 4 (CN3.28)
/PWM3A_BO: 2 (IC5.17 TP2.1), 4 (CN3.29)
/PWM3B_BO: 2 (IC5.18 TP1.1), 4 (CN3.30)
/PWM4A_BO: 2 (IC6.13 TP12.1), 4 (CN3.33)
/PWM4B_BO: 2 (IC6.14 TP11.1), 4 (CN3.34)
/PWM5A_BO: 2 (IC6.15 TP10.1), 4 (CN3.35)
/PWM5B_BO: 2 (IC6.16 TP9.1), 4 (CN3.36)
/PWM6A_BO: 2 (IC6.17 TP8.1), 4 (CN3.37)
/PWM6B_BO: 2 (IC6.18 TP7.1), 4 (CN3.38)
/RESET_BO: 2 (IC8.4 PAD9.1), 4 (CN3.49)
/RESET_SIG: 1 (IC2.4 IC3.124 R7.2), 2 (IC8.2)
AD0: 3 (R50.2), 4 (CN3.9)
AD1: 3 (R54.2), 4 (CN3.10)
AD2: 3 (R55.1), 4 (CN3.13)
AD3: 3 (R51.1), 4 (CN3.14)
AD4: 3 (R62.2), 4 (CN3.17)
AD5: 3 (R66.2), 4 (CN3.18)
AD6: 3 (R67.1), 4 (CN3.21)
AD7: 3 (R63.1), 4 (CN3.22)
ADC01_P_DSP41: 1 (IC3.41), 3 (C63.1 R58.1)
ADC02_P_DSP39: 1 (IC3.39), 3 (C65.1 R60.1)
ADC03_P_DSP48: 1 (IC3.48), 3 (C64.1 R59.1)
ADC04_P_DSP44: 1 (IC3.44), 3 (C66.1 R61.1)
ADC05_P_DSP31: 1 (IC3.31 IC3.40), 3 (C72.1 R70.1)
ADC06_P_DSP29: 1 (IC3.29 IC3.49), 3 (C74.1 R72.1)
ADC07_P_DSP56: 1 (IC3.56), 3 (C73.1 R71.1)
ADC08_P_DSP58: 1 (IC3.58), 3 (C75.1 R73.1)
BOOT1_DSP: 1 (CN2.14 R17.2), 3 (R29.2 SW2.3)
BOOT1_DSP139: 1 (IC3.139), 3 (R29.1)
CANRX_A_DSP83: 1 (IC3.83), 4 (IC12.4)
CANTX_A_DSP84: 1 (IC3.84), 4 (IC12.1 R83.2)
DI0_DSP132: 1 (IC3.132), 4 (IC11.18 PAD10.1)
DI1_DSP133: 1 (IC3.133), 4 (IC11.17 PAD11.1)
DI2_DSP140: 1 (IC3.140), 4 (IC11.16 PAD12.1)
DI3_DSP141: 1 (IC3.141), 4 (IC11.15 PAD13.1)
DI4_DSP142: 1 (IC3.142), 4 (IC11.14 PAD14.1)
DI5_DSP143: 1 (IC3.143), 4 (IC11.13 PAD15.1)
DI6_DSP144: 1 (IC3.144), 4 (IC11.12 PAD16.1)
DI7_DSP145: 1 (IC3.145), 4 (IC11.11 PAD17.1)
DIO08_DSP94: 1 (IC3.94), 4 (D17.K/A R88.2 R96.2)
DIO09_DSP95: 1 (IC3.95), 4 (D18.K/A R89.2 R98.2)
DIO10_DSP96: 1 (IC3.96), 4 (D19.K/A R90.2 R99.2)
DIO11_DSP97: 1 (IC3.97), 4 (D20.K/A R91.2 R97.2)
DIO12_DSP171: 1 (IC3.171), 4 (D21.K/A R92.2 R100.2)
DIO13_DSP172: 1 (IC3.172), 4 (D22.K/A R93.2 R101.2)
DIO14_DSP175: 1 (IC3.175), 4 (D23.K/A R94.2 R102.2)
DIO15_DSP176: 1 (IC3.176), 4 (D24.K/A R95.2 R103.2)
DO0_DSP8: 1 (IC3.8), 2 (IC7.9 R49.1)
DO1_DSP9: 1 (IC3.9), 2 (IC7.8 R48.1)
DO2_DSP10: 1 (IC3.10), 2 (IC7.7 R47.1)
DO3_DSP12: 1 (IC3.12), 2 (IC7.6 R46.1)
DO4_DSP13: 1 (IC3.13), 2 (IC7.5 R45.1)
DO5_DSP14: 1 (IC3.14), 2 (IC7.4 R44.1)
DO6_DSP22: 1 (IC3.22), 2 (IC7.3 R43.1)
DO7_DSP23: 1 (IC3.23), 2 (IC7.2 R42.1)
NetC8_1: 1 (6 pins), 4 (5 pins)
NetC10_1: 1 (10 pins), 4 (C91.1 IC15.5 PAD20.1)
NetC20_1: 1 (21 pins), 4 (5 pins)
NetC54_1: 2 (8 pins), 4 (35 pins)
PWM1A_DSP160: 1 (IC3.160), 2 (IC5.7 R35.1)
PWM1B_DSP161: 1 (IC3.161), 2 (IC5.6 R34.1)
PWM2A_DSP162: 1 (IC3.162), 2 (IC5.5 R33.1)
PWM2B_DSP163: 1 (IC3.163), 2 (IC5.4 R32.1)
PWM3A_DSP164: 1 (IC3.164), 2 (IC5.3 R31.1)
PWM3B_DSP165: 1 (IC3.165), 2 (IC5.2 R30.1)
PWM4A_DSP166: 1 (IC3.166), 2 (IC6.7 R41.1)
PWM4B_DSP167: 1 (IC3.167), 2 (IC6.6 R40.1)
PWM5A_DSP18: 1 (IC3.18), 2 (IC6.5 R39.1)
PWM5B_DSP19: 1 (IC3.19), 2 (IC6.4 R38.1)
PWM6A_DSP1: 1 (IC3.1), 2 (IC6.3 R37.1)
PWM6B_DSP2: 1 (IC3.2), 2 (IC6.2 R36.1)
SCIRX_B_DSP157: 1 (IC3.157), 4 (IC14.4)
SCITX_B_DSP156: 1 (IC3.156), 4 (IC13.2 R84.2)
SCITXDA_DSP154: 1 (CN2.1 IC3.154), 3 (R28.1)
SCL_A_DSP131: 1 (IC3.131), 3 (IC4.6 R20.1)
SDA_A_DSP130: 1 (IC3.130), 3 (IC4.5 R21.1)
SIG206: 1 (80 pins), 2 (40 pins), 3 (48 pins), 4 (65 pins)
SIG462: 1 (75 pins), 3 (14 pins), 4 (33 pins)